# EAGLE design DemoBoard (EAGLE 9.6.2)

## Sheet 1 of 3
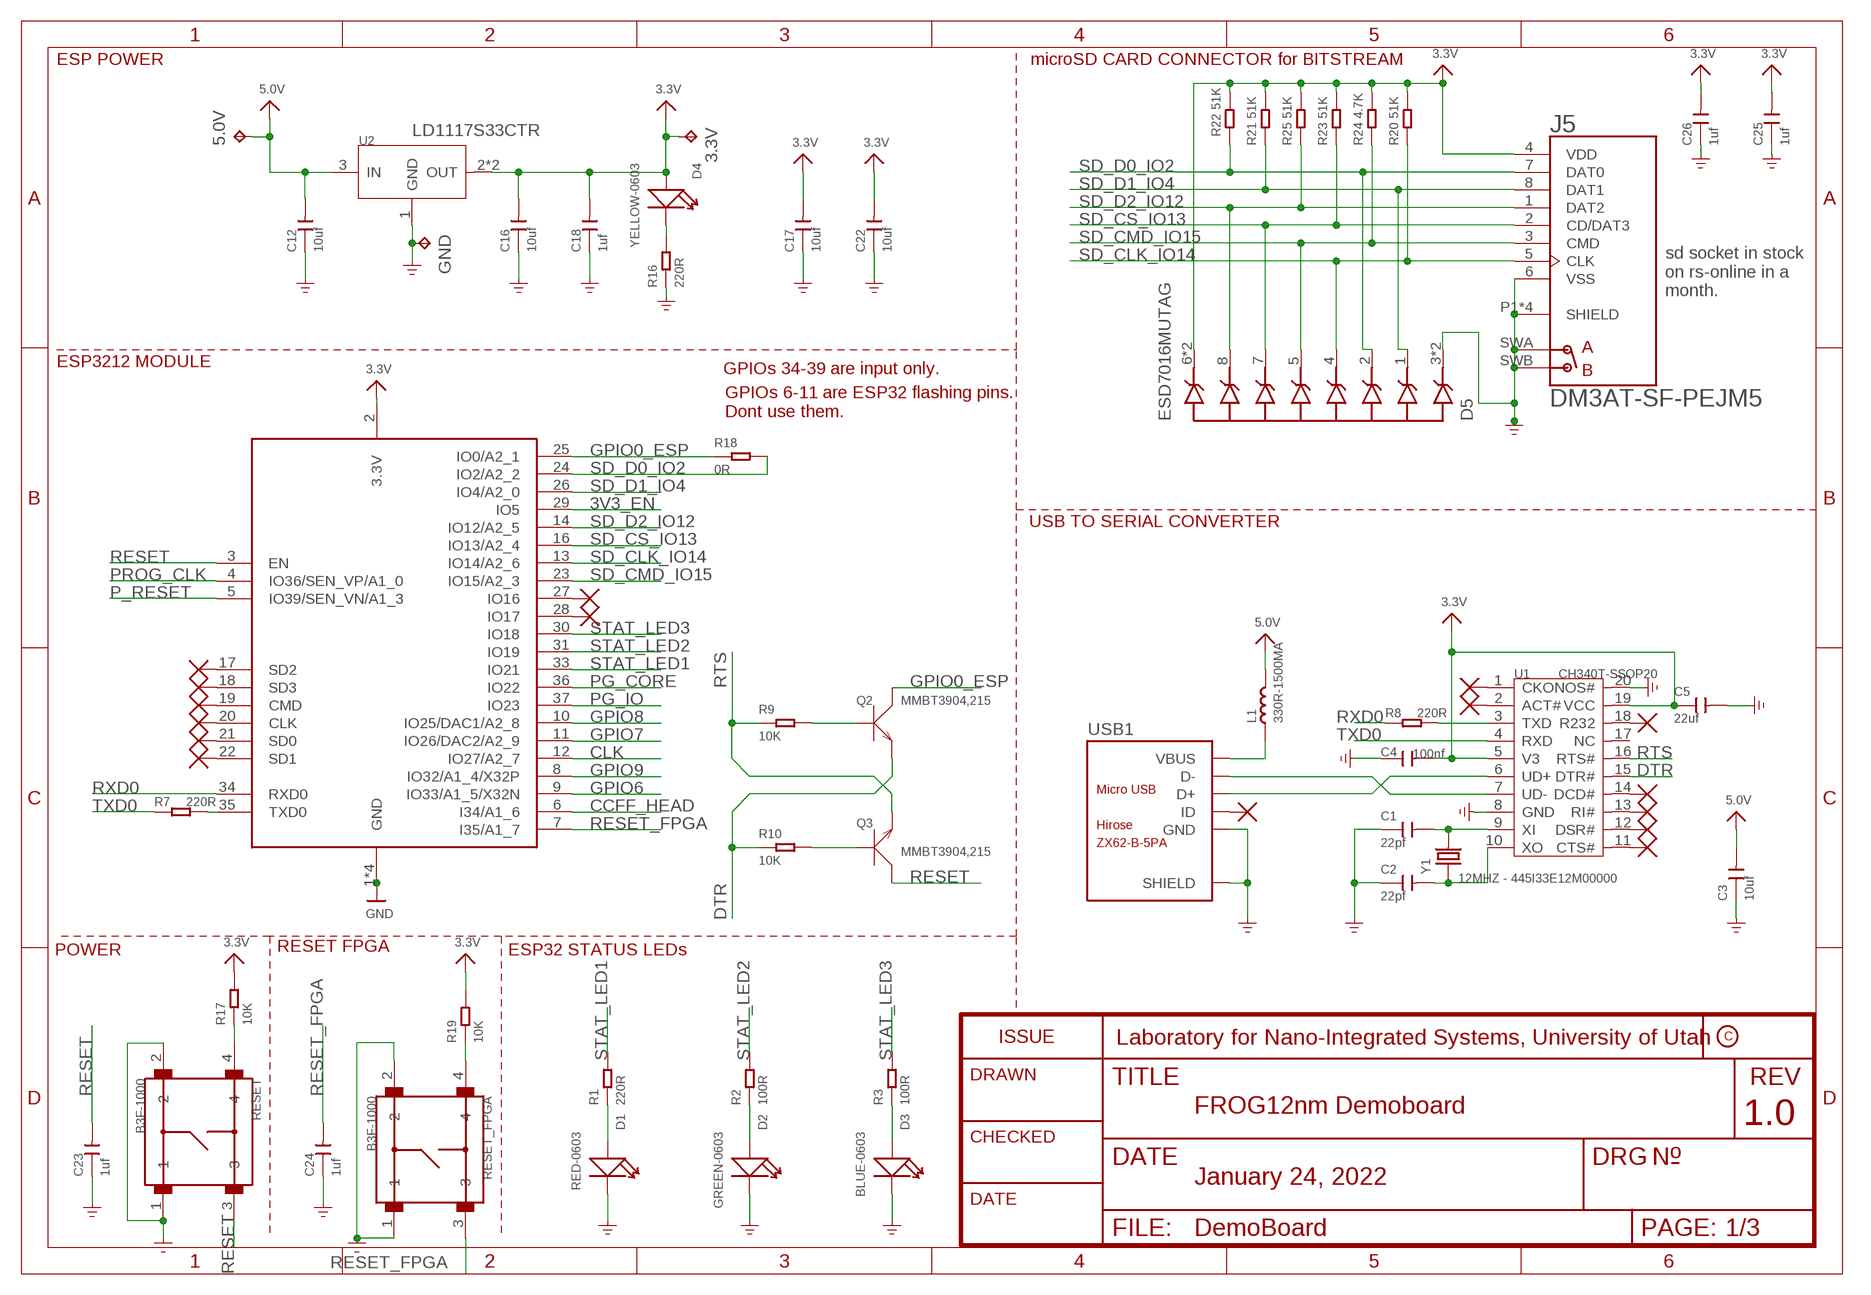
[diagram p0: schematic, sheet 1]
FRAME1 (FRAME_A4): COMPANY: TETRAD: SENSOR NETWORK SOLUTIONS, LLC; REV: 1.0

### Parts
3.3V  TPTP20SQ  [TP20SQ]
5.0V  TPTP20SQ  [TP20SQ]
C1  22pf  CERAMIC-22PF-50V-5%-NPO(0603)  [C0603]
C2  22pf  CERAMIC-22PF-50V-5%-NPO(0603)  [C0603]
C3  10uf  CERAMIC-10UF-10V-10%-X5R(0603)  [C0603]
C4  100nf  CERAMIC-100NF-50V-10%-X7R(0603)  [C0603]
C5  22uf  CERAMIC-22UF-6.3V-20%-X5R(0805)  [C0805]
C12  10uf  CERAMIC-10UF-10V-10%-X5R(0603)  [C0603]
C16  10uf  CERAMIC-10UF-10V-10%-X5R(0603)  [C0603]
C17  10uf  CERAMIC-10UF-10V-10%-X5R(0603)  [C0603]
C18  1uf  CERAMIC-1UF-25V-10%-X7R(0603)  [C0603]
C22  10uf  CERAMIC-10UF-10V-10%-X5R(0603)  [C0603]
C23  1uf  CERAMIC-1UF-25V-10%-X7R(0603)  [C0603]
C24  1uf  CERAMIC-1UF-25V-10%-X7R(0603)  [C0603]
C25  1uf  CERAMIC-1UF-25V-10%-X7R(0603)  [C0603]
C26  1uf  CERAMIC-1UF-25V-10%-X7R(0603)  [C0603]
D1  RED-0603  LED-SMD-RED-DIFFUSED(0603)  [LED-0603]
D2  GREEN-0603  SMD-LED-CLEAR-GREEN(0603)  [LED-0603]
D3  BLUE-0603  SMD-LED-CLEAR-BLUE(0603)  [LED-0603]
D4  YELLOW-0603  SMD-LED-CLEAR-YELLOW(0603)  [LED-0603]
D5  ESD7016MUTAG  [TVS_ESD7016MUTAG]
GND  TPTP20SQ  [TP20SQ]
J5  DM3AT-SF-PEJM5  [HRS_DM3AT-SF-PEJM5]
L1  330R-1500MA  SMD-FERRITE-BEAD-330R-1500MA(0805)'0805'  [L0805]
Q2  MMBT3904,215  SMD-TRANSISTORS-NPN-40V-200MA-MMBT3904LT1G(SOT-23)  [SOT-23]
Q3  MMBT3904,215  SMD-TRANSISTORS-NPN-40V-200MA-MMBT3904LT1G(SOT-23)  [SOT-23]
R1  220R  SMD-RES-220R-5%-1/10W(0603)  [R0603]
R2  100R  SMD-RES-10R-5%-1/10W(0603)  [R0603]
R3  100R  SMD-RES-100R-5%-1/10W(0603)  [R0603]
R7  220R  SMD-RES-220R-5%-1/10W(0603)  [R0603]
R8  220R  SMD-RES-220R-5%-1/10W(0603)  [R0603]
R9  10K  SMD-RES-10K-1%-1/10W(0603)  [R0603]
R10  10K  SMD-RES-10K-1%-1/10W(0603)  [R0603]
R16  220R  SMD-RES-220R-5%-1/10W(0603)  [R0603]
R17  10K  SMD-RES-10K-1%-1/10W(0603)  [R0603]
R18  0R  SMD-RES-0R-5%-1/10W(0603)  [R0603]
R19  10K  SMD-RES-10K-1%-1/10W(0603)  [R0603]
R20  51K  SMD-RES-51K-5%-1/10W(0603)  [R0603]
R21  51K  SMD-RES-51K-5%-1/10W(0603)  [R0603]
R22  51K  SMD-RES-51K-5%-1/10W(0603)  [R0603]
R23  51K  SMD-RES-51K-5%-1/10W(0603)  [R0603]
R24  4.7K  SMD-RES-4.7K-5%-1/10W(0603)  [R0603]
R25  51K  SMD-RES-51K-5%-1/10W(0603)  [R0603]
RESET  B3F-1000  [SW_B3F-1000]
RESET_FPGA  B3F-1000  [SW_B3F-1000]
U1  CH340T-SSOP20  INTERFACE-CH340T(SSOP20)  [SSOP20-0.65-7.6X5.2MM]
U2  PMIC-CJT1117-3.3(SOT223)  [SOT-223]
U3  ESP32_WROOM32_SKINNY  [WROOM32_SKINNY]
U$4  NC_MARKER  (no package)
U$5  NC_MARKER  (no package)
U$42  NC_MARKER  (no package)
U$44  NC_MARKER  (no package)
U$55  NC_MARKER  (no package)
U$57  NC_MARKER  (no package)
U$59  NC_MARKER  (no package)
U$60  NC_MARKER  (no package)
U$65  NC_MARKER  (no package)
U$66  NC_MARKER  (no package)
U$67  NC_MARKER  (no package)
U$68  NC_MARKER  (no package)
U$69  NC_MARKER  (no package)
U$78  NC_MARKER  (no package)
U$81  NC_MARKER  (no package)
U$85  NC_MARKER  (no package)
USB1  ZX62-B-5PA  MICRO-USB-SMD(ZX62-B-5PA)  [MICRO-USB5+6P-SMD-0.65-AB]
Y1  12MHZ - 445I33E12M00000  SMD-CRYSTAL-12MHZ-20PF-20PPM-40R(2P-5.0X3.2MM)  [X2-SMD-5.0X3.2X1.3MM]

### Nets
3.3V: 3.3V.TP C4.2 C5.1 C16.2 C17.2 C18.2 C22.2 C25.2 C26.2 D4.+ D5.6(GND) D5.9(GND) J5.4(VDD) R17.2 R19.2 R20.2 R21.2 R22.2 R23.2 R24.2 R25.2 U1.5(V3) U1.19(VCC) U2.2(OUT) U2.TER(OUT) U3.2(3.3V) ; also sheet 2,3
3V3_EN: U3.29(IO5) ; also sheet 3
5.0V: 5.0V.TP C3.2 C12.2 L1.2 U2.3(IN) ; also sheet 2
CCFF_HEAD: U3.6(I34/A1_6) ; also sheet 2
CLK: U3.12(IO27/A2_7) ; also sheet 2,3
DTR: Q2.2(E) R10.1 U1.15(DTR#)
GND: C1.1 C2.1 C3.1 C4.1 C5.2 C12.1 C16.1 C17.1 C18.1 C22.1 C23.1 C24.1 C25.1 C26.1 D1.- D2.- D3.- D5.3(VBUS) D5.10(VBUS) GND.TP J5.6(VSS) J5.P1(SHIELD) J5.P2(SHIELD) J5.P3(SHIELD) J5.P4(SHIELD) J5.SWA(A) J5.SWB(B) R16.1 RESET.1 RESET.2 RESET_FPGA.1 RESET_FPGA.2 U1.8(GND) U1.20(NOS#) U2.1(GND) U3.1(GND) U3.15(GND) U3.38(GND) U3.P$1(GND) USB1.5(GND) USB1.P1(SHIELD) USB1.P2(SHIELD) USB1.P3_1(SHIELD) USB1.P3_2(SHIELD) USB1.P3_3(SHIELD) USB1.P4_1(SHIELD) USB1.P4_2(SHIELD) USB1.P4_3(SHIELD) USB1.P5(SHIELD) USB1.P6(SHIELD) ; supply symbol labelled GND_POWER ; also sheet 2,3
GPIO0_ESP: Q2.3(C) R18.1 U3.25(IO0/A2_1)
GPIO6: U3.9(IO33/A1_5/X32N) ; also sheet 2,3
GPIO7: U3.11(IO26/DAC2/A2_9) ; also sheet 2,3
GPIO8: U3.10(IO25/DAC1/A2_8) ; also sheet 2,3
GPIO9: U3.8(IO32/A1_4/X32P) ; also sheet 2,3
N$1: D2.+ R2.1
N$2: R17.1 RESET.4
N$3: R19.1 RESET_FPGA.4
N$7: D1.+ R1.1
N$12: Q3.1(B) R10.2
N$13: Q2.1(B) R9.2
N$22: D3.+ R3.1
N$25: D4.- R16.2
N$26: U1.7(UD-) USB1.2(D-)
N$27: U1.6(UD+) USB1.3(D+)
N$28: C1.2 U1.9(XI) Y1.2
N$29: C2.2 U1.10(XO) Y1.1
N$30: R8.2 U1.3(TXD)
N$33: R7.2 U3.35(TXD0)
N$48: U3.17(SD2) U$42.P$1
N$50: U3.18(SD3) U$44.P$1
N$51: U3.19(CMD) U$55.P$1
N$52: U3.20(CLK) U$57.P$1
N$53: U3.21(SD0) U$59.P$1
N$54: U3.22(SD1) U$60.P$1
N$64: U1.14(DCD#) U$4.P$1
N$65: U1.13(RI#) U$5.P$1
N$66: U1.12(DSR#) U$65.P$1
N$67: U1.11(CTS#) U$66.P$1
N$68: U1.18(R232) U$67.P$1
N$69: U1.1(CKO) U$68.P$1
N$70: U1.2(ACT#) U$69.P$1
N$72: U$78.P$1 USB1.4(ID)
N$73: U3.27(IO16) U$81.P$1
N$75: U3.28(IO17) U$85.P$1
P_RESET: U3.5(IO39/SEN_VN/A1_3) ; also sheet 2
PG_CORE: U3.36(IO22) ; also sheet 2
PG_IO: U3.37(IO23) ; also sheet 2
PROG_CLK: U3.4(IO36/SEN_VP/A1_0) ; also sheet 2
RESET: C23.2 Q3.3(C) RESET.3 U3.3(EN)
RESET_FPGA: C24.2 RESET_FPGA.3 U3.7(I35/A1_7) ; also sheet 2
RTS: Q3.2(E) R9.1 U1.16(RTS#)
RXD0: R8.1 U3.34(RXD0)
SD_CLK_IO14: D5.4(I/O3) J5.5(CLK) R20.1 U3.13(IO14/A2_6)
SD_CMD_IO15: D5.5(I/O4) J5.3(CMD) R24.1 U3.23(IO15/A2_3)
SD_CS_IO13: D5.7(I/O5) J5.2(CD/DAT3) R23.1 U3.16(IO13/A2_4)
SD_D0_IO2: D5.2(I/O2) J5.7(DAT0) R18.2 R22.1 U3.24(IO2/A2_2)
SD_D1_IO4: D5.1(I/O1) J5.8(DAT1) R21.1 U3.26(IO4/A2_0)
SD_D2_IO12: D5.8(I/O6) J5.1(DAT2) R25.1 U3.14(IO12/A2_5)
STAT_LED1: R1.2 U3.33(IO21)
STAT_LED2: R2.2 U3.31(IO19)
STAT_LED3: R3.2 U3.30(IO18)
TXD0: R7.1 U1.4(RXD)
VBUS: L1.1 USB1.1(VBUS)
Unconnected: U1.17(NC)

### Notes on the sheet
- ESP POWER | microSD CARD CONNECTOR for BITSTREAM
- sd socket in stock 
  on rs-online in a 
  month.
- ESP3212 MODULE
- GPIOs 34-39 are input only.
- GPIOs 6-11 are ESP32 flashing pins.
  Dont use them.
- USB TO SERIAL CONVERTER
- POWER | RESET FPGA | ESP32 STATUS LEDs
- Laboratory for Nano-Integrated Systems, University of Utah
- FROG12nm Demoboard
- January 24, 2022

## Sheet 2 of 3
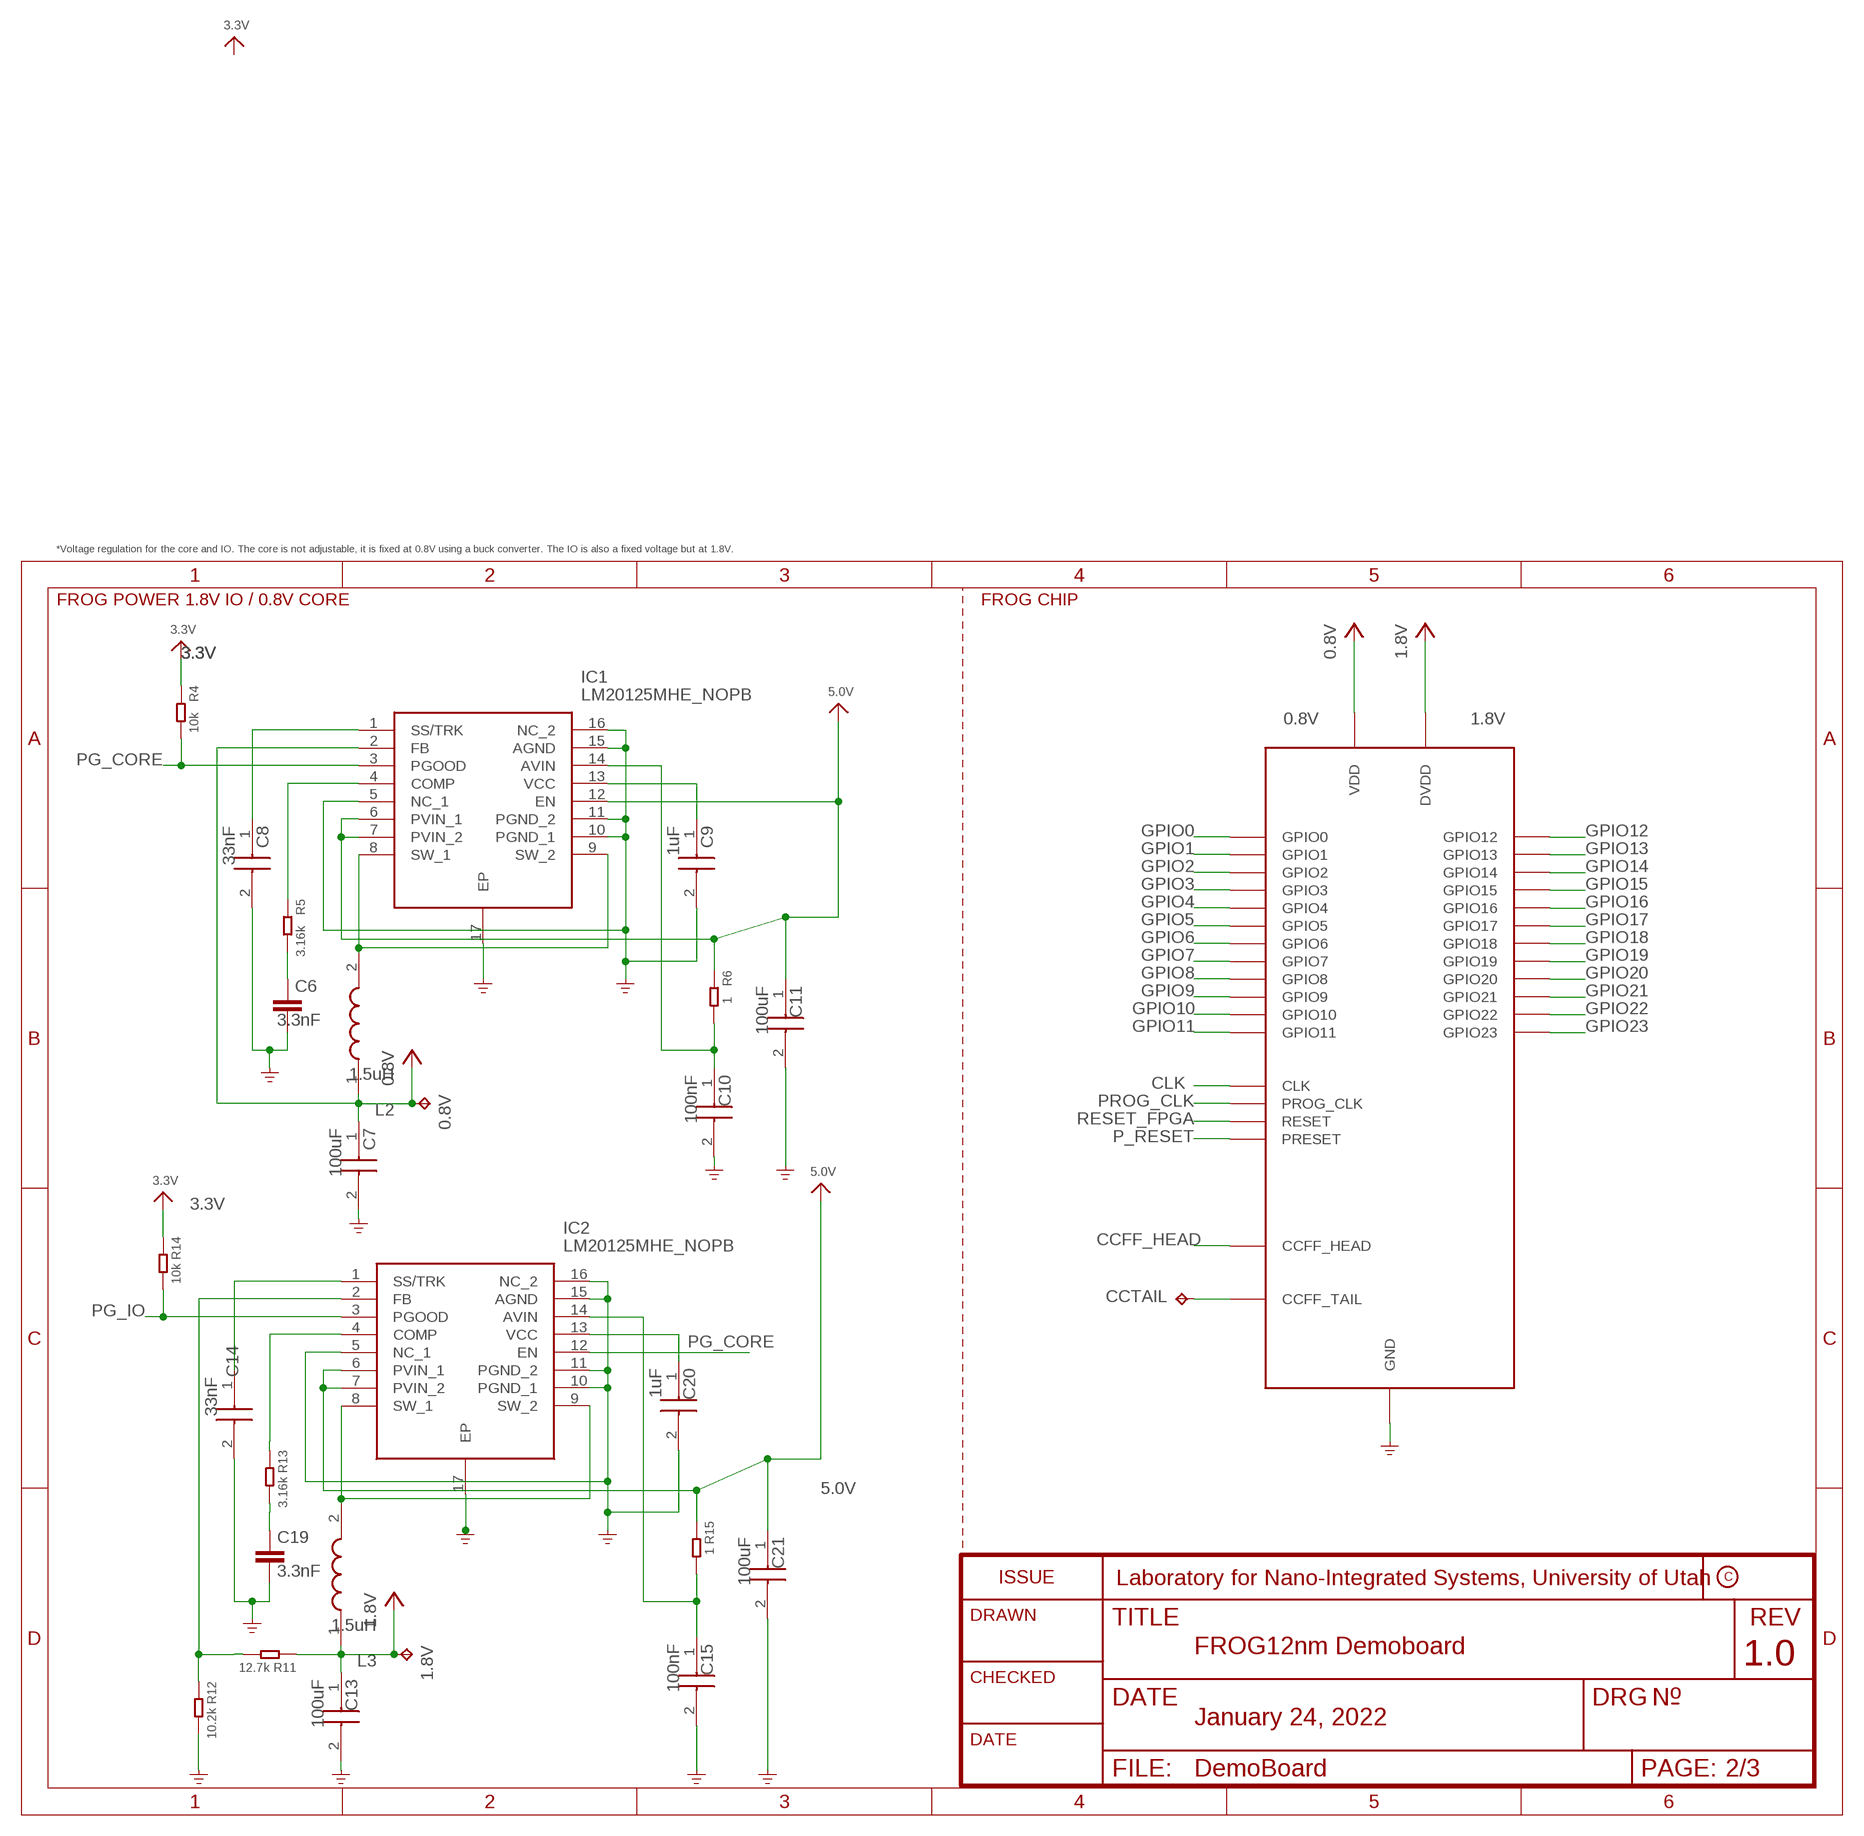
[diagram p1: schematic, sheet 2]
FRAME2 (FRAME_A4): COMPANY: TETRAD: SENSOR NETWORK SOLUTIONS, LLC; REV: 1.0

### Parts
0.8V  TPTP20SQ  [TP20SQ]
1.8V  TPTP20SQ  [TP20SQ]
C6  3.3nF  C_CHIP-0603(1608-METRIC)  [CAPC1608X85]
C7  100uF  GRM32ER60J107ME20L  [CAPC3225X270N]
C8  33nF  VJ0603Y333KXXAC  [CAPC1608X97N]
C9  1uF  GRM155R61E105KA12D  [CAPC1005X55N]
C10  100nF  GCM155R71C104KA55D  [CAPC1005X55N]
C11  100uF  GRM32ER60J107ME20L  [CAPC3225X270N]
C13  100uF  GRM32ER60J107ME20L  [CAPC3225X270N]
C14  33nF  VJ0603Y333KXXAC  [CAPC1608X97N]
C15  100nF  GCM155R71C104KA55D  [CAPC1005X55N]
C19  3.3nF  C_CHIP-0603(1608-METRIC)  [CAPC1608X85]
C20  1uF  GRM155R61E105KA12D  [CAPC1005X55N]
C21  100uF  GRM32ER60J107ME20L  [CAPC3225X270N]
CCTAIL  TPPAD1-13  [P1-13]
IC1  LM20125MHE_NOPB  [SOP65P640X120-17N]
IC2  LM20125MHE_NOPB  [SOP65P640X120-17N]
L2  1.5uH  FDSD0630-H-1R0MB=P3  [INDPM7066X300N]
L3  1.5uH  FDSD0630-H-1R0MB=P3  [INDPM7066X300N]
R4  10k  SMD-RES-4.7K-5%-1/10W(0603)  [R0603]
R5  3.16k  SMD-RES-4.7K-5%-1/10W(0603)  [R0603]
R6  1  SMD-RES-4.7K-5%-1/10W(0603)  [R0603]
R11  12.7k  SMD-RES-4.7K-5%-1/10W(0603)  [R0603]
R12  10.2k  SMD-RES-4.7K-5%-1/10W(0603)  [R0603]
R13  3.16k  SMD-RES-4.7K-5%-1/10W(0603)  [R0603]
R14  10k  SMD-RES-4.7K-5%-1/10W(0603)  [R0603]
R15  1  SMD-RES-4.7K-5%-1/10W(0603)  [R0603]
U5  FROG12NMCOBCOB  [FROG_COB]

### Nets
0.8V: 0.8V.TP C7.1 IC1.2(FB) L2.1 U5.VDD_CORE(VDD)
1.8V: 1.8V.TP C13.1 L3.1 R11.1 U5.VDD_IO(DVDD)
3.3V: R4.1 R14.1 ; also sheet 1,3
5.0V: C11.1 C21.1 IC1.6(PVIN_1) IC1.7(PVIN_2) IC1.12(EN) IC2.6(PVIN_1) IC2.7(PVIN_2) R6.1 R15.1 ; also sheet 1
CCFF_HEAD: U5.CCFFHEAD(CCFF_HEAD) ; also sheet 1
CLK: U5.CLK ; also sheet 1,3
GND: C6.2 C7.2 C8.2 C9.2 C10.2 C11.2 C13.2 C14.2 C15.2 C19.2 C20.2 C21.2 IC1.5(NC_1) IC1.10(PGND_1) IC1.11(PGND_2) IC1.15(AGND) IC1.16(NC_2) IC1.17(EP) IC2.5(NC_1) IC2.10(PGND_1) IC2.11(PGND_2) IC2.15(AGND) IC2.16(NC_2) IC2.17(EP) R12.2 U5.GND ; supply symbol labelled GND_POWER ; also sheet 1,3
GPIO0: U5.GPIO0 ; also sheet 3
GPIO1: U5.GPIO1 ; also sheet 3
GPIO2: U5.GPIO2 ; also sheet 3
GPIO3: U5.GPIO3 ; also sheet 3
GPIO4: U5.GPIO4 ; also sheet 3
GPIO5: U5.GPIO5 ; also sheet 3
GPIO6: U5.GPIO6 ; also sheet 1,3
GPIO7: U5.GPIO7 ; also sheet 1,3
GPIO8: U5.GPIO8 ; also sheet 1,3
GPIO9: U5.GPIO9 ; also sheet 1,3
GPIO10: U5.GPIO10 ; also sheet 3
GPIO11: U5.GPIO11 ; also sheet 3
GPIO12: U5.GPIO12 ; also sheet 3
GPIO13: U5.GPIO13 ; also sheet 3
GPIO14: U5.GPIO14 ; also sheet 3
GPIO15: U5.GPIO15 ; also sheet 3
GPIO16: U5.GPIO16 ; also sheet 3
GPIO17: U5.GPIO17 ; also sheet 3
GPIO18: U5.GPIO18 ; also sheet 3
GPIO19: U5.GPIO19 ; also sheet 3
GPIO20: U5.GPIO20 ; also sheet 3
GPIO21: U5.GPIO21 ; also sheet 3
GPIO22: U5.GPIO22 ; also sheet 3
GPIO23: U5.GPIO23 ; also sheet 3
N$14: IC1.4(COMP) R5.1
N$17: C6.1 R5.2
N$20: C9.1 IC1.13(VCC)
N$34: C8.1 IC1.1(SS/TRK)
N$35: IC1.8(SW_1) IC1.9(SW_2) L2.2
N$36: CCTAIL.TP U5.CCFFTAIL(CCFF_TAIL)
N$37: C10.1 IC1.14(AVIN) R6.2
N$38: IC2.4(COMP) R13.1
N$39: C19.1 R13.2
N$40: C20.1 IC2.13(VCC)
N$41: C14.1 IC2.1(SS/TRK)
N$42: IC2.8(SW_1) IC2.9(SW_2) L3.2
N$43: C15.1 IC2.14(AVIN) R15.2
P_RESET: U5.PRESET ; also sheet 1
PG_CORE: IC1.3(PGOOD) IC2.12(EN) R4.2 ; also sheet 1
PG_IO: IC2.3(PGOOD) R14.2 ; also sheet 1
PROG_CLK: U5.PROGCLK(PROG_CLK) ; also sheet 1
RESET_FPGA: U5.RESET ; also sheet 1
VDD_CORE: IC2.2(FB) R11.2 R12.1

### Notes on the sheet
- *Voltage regulation for the core and IO. The core is not adjustable, it is fixed at 0.8V using a buck converter. The IO is also a fixed voltage but at 1.8V.
- FROG POWER 1.8V IO / 0.8V CORE | FROG CHIP
- Laboratory for Nano-Integrated Systems, University of Utah
- FROG12nm Demoboard
- January 24, 2022

## Sheet 3 of 3
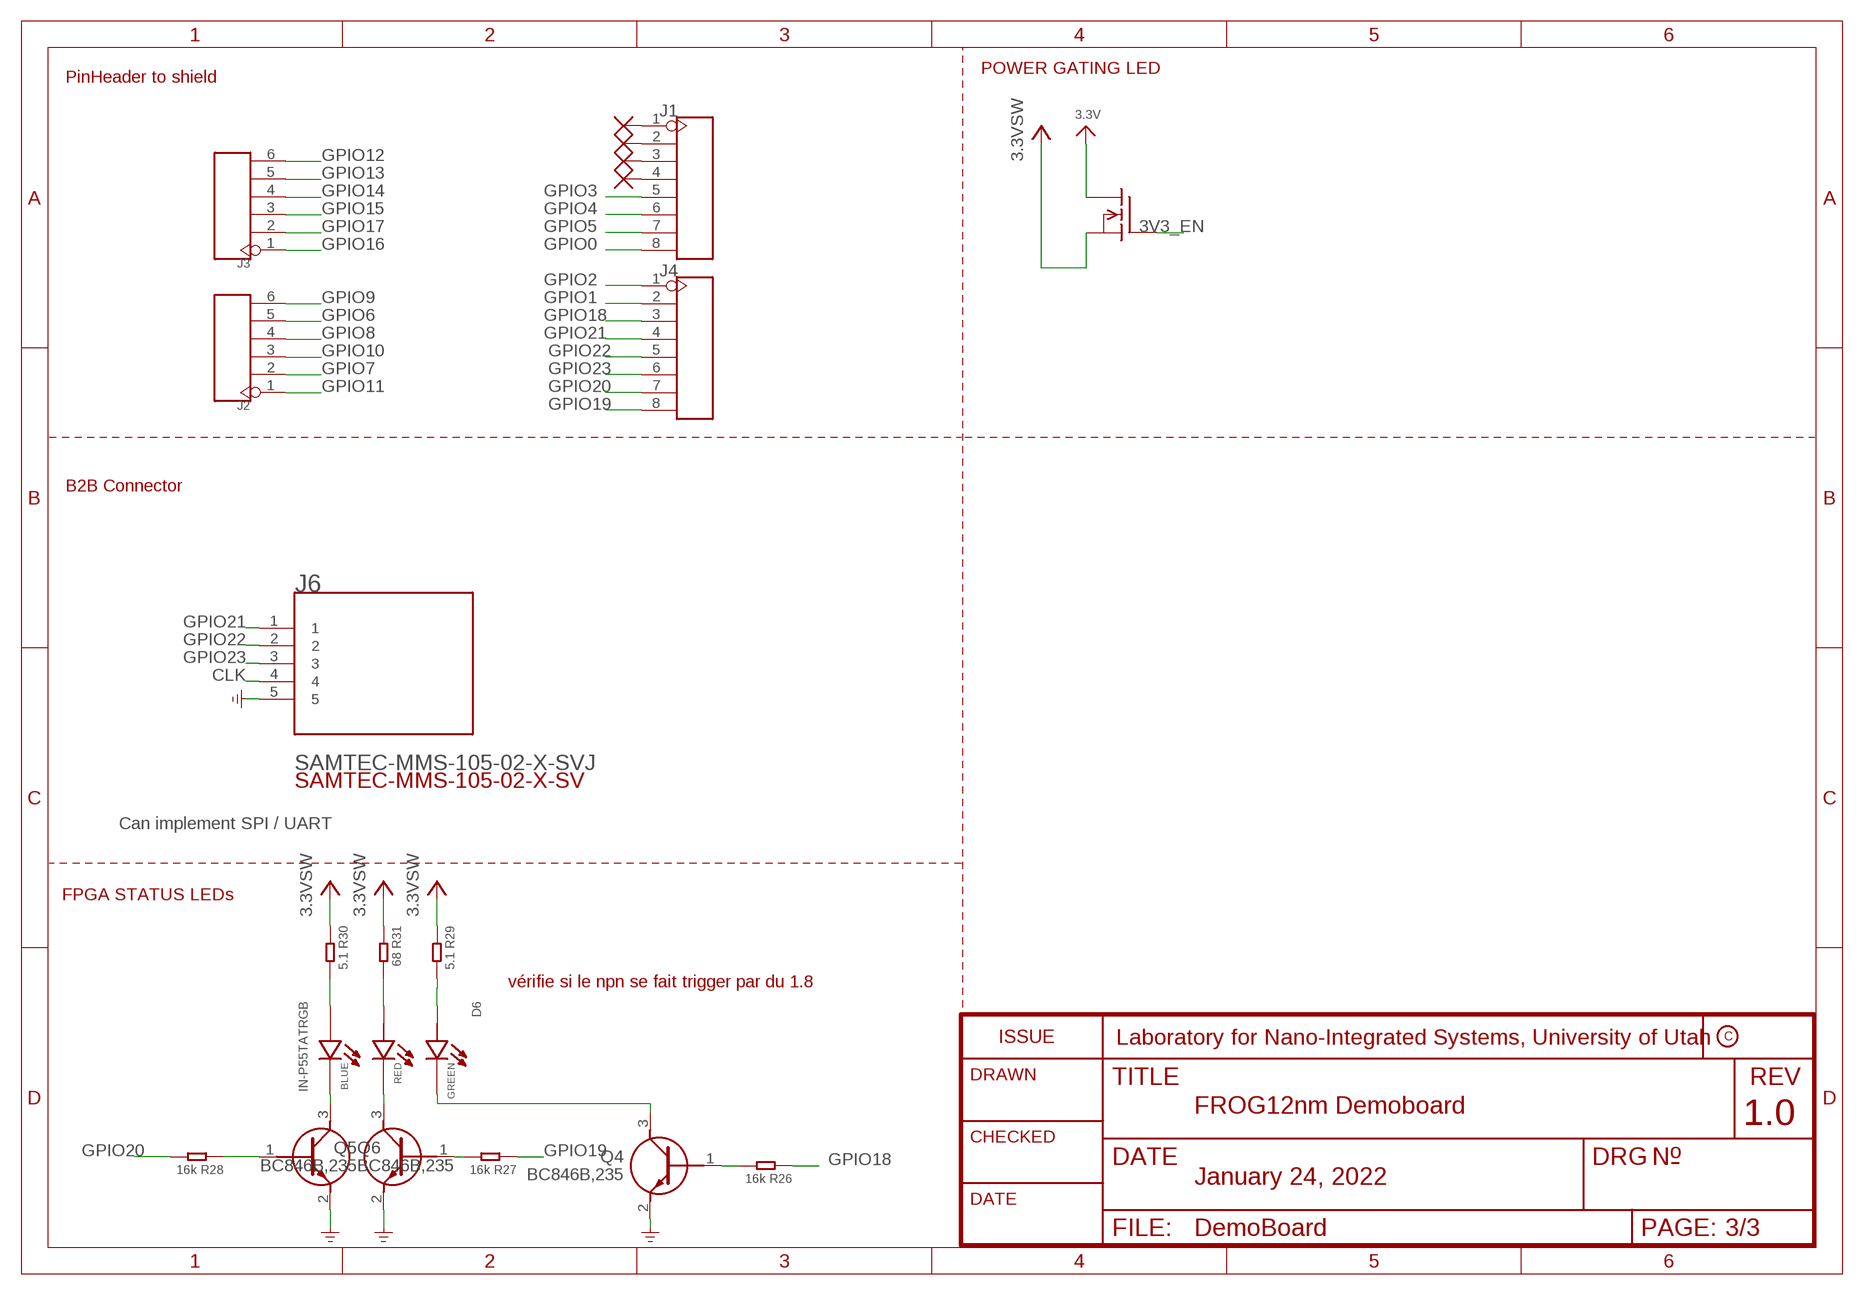
[diagram p2: schematic, sheet 3]
FRAME3 (FRAME_A4): COMPANY: TETRAD: SENSOR NETWORK SOLUTIONS, LLC; REV: 1.0

### Parts
D6  IN-P55TATRGB  [LED_IN-P55TATRGB]
J1  HEADER-8P-2.54  [8P-2.54]
J2  HEADER-6P-55/35MIL  [6P-2.54-55/35MIL]
J3  HEADER-6P-55/35MIL  [6P-2.54-55/35MIL]
J4  HEADER-8P-2.54  [8P-2.54]
J6  SAMTEC-MMS-105-02-X-SVJ  [SAMTEC-MMS-105-02-X-SV]
Q1  IRLML0030TRPBF  [SOT23]
Q4  BC846B,235  [SOT95P230X110-3N]
Q5  BC846B,235  [SOT95P230X110-3N]
Q6  BC846B,235  [SOT95P230X110-3N]
R26  16k  SMD-RES-4.7K-5%-1/10W(0603)  [R0603]
R27  16k  SMD-RES-4.7K-5%-1/10W(0603)  [R0603]
R28  16k  SMD-RES-4.7K-5%-1/10W(0603)  [R0603]
R29  5.1  SMD-RES-4.7K-5%-1/10W(0603)  [R0603]
R30  5.1  SMD-RES-4.7K-5%-1/10W(0603)  [R0603]
R31  68  SMD-RES-4.7K-5%-1/10W(0603)  [R0603]
U$61  NC_MARKER  (no package)
U$62  NC_MARKER  (no package)
U$63  NC_MARKER  (no package)
U$64  NC_MARKER  (no package)

### Nets
3.3V: Q1.3(D) ; also sheet 1,2
3.3VSW: Q1.2(S) R29.1 R30.1 R31.1
3V3_EN: Q1.1(G) ; also sheet 1
CLK: J6.4 ; also sheet 1,2
GND: J6.5 Q4.2(E) Q5.2(E) Q6.2(E) ; supply symbol labelled GND_POWER ; also sheet 1,2
GPIO0: J1.8 ; also sheet 2
GPIO1: J4.2 ; also sheet 2
GPIO2: J4.1 ; also sheet 2
GPIO3: J1.5 ; also sheet 2
GPIO4: J1.6 ; also sheet 2
GPIO5: J1.7 ; also sheet 2
GPIO6: J2.5 ; also sheet 1,2
GPIO7: J2.2 ; also sheet 1,2
GPIO8: J2.4 ; also sheet 1,2
GPIO9: J2.6 ; also sheet 1,2
GPIO10: J2.3 ; also sheet 2
GPIO11: J2.1 ; also sheet 2
GPIO12: J3.6 ; also sheet 2
GPIO13: J3.5 ; also sheet 2
GPIO14: J3.4 ; also sheet 2
GPIO15: J3.3 ; also sheet 2
GPIO16: J3.1 ; also sheet 2
GPIO17: J3.2 ; also sheet 2
GPIO18: J4.3 R26.1 ; also sheet 2
GPIO19: J4.8 R27.1 ; also sheet 2
GPIO20: J4.7 R28.2 ; also sheet 2
GPIO21: J4.4 J6.1 ; also sheet 2
GPIO22: J4.5 J6.2 ; also sheet 2
GPIO23: J4.6 J6.3 ; also sheet 2
N$31: D6.1(B_C) Q6.3(C)
N$32: Q5.1(B) R27.2
N$44: D6.2(R_C) Q5.3(C)
N$45: D6.3(G_C) Q4.3(C)
N$47: Q6.1(B) R28.1
N$49: Q4.1(B) R26.2
N$55: J1.4 U$61.P$1
N$56: J1.3 U$62.P$1
N$57: D6.5(R_A) R31.2
N$58: J1.2 U$63.P$1
N$59: J1.1 U$64.P$1
VCC2: D6.4(G_A) D6.6(B_A) R29.2 R30.2

### Notes on the sheet
- POWER GATING LED
- PinHeader to shield
- B2B Connector
- Can implement SPI / UART
- FPGA STATUS LEDs
- vérifie si le npn se fait trigger par du 1.8
- Laboratory for Nano-Integrated Systems, University of Utah
- FROG12nm Demoboard
- January 24, 2022

## Library data of the parts
0.8V 1.8V 3.3V 5.0V CCTAIL GND = testpad:TP: Test pad
C1 C2 = Seeed-Capacitor:CERAMIC-22PF-50V-5%-NPO(0603): 302010143; MPN: CC0603JRNPO9BN220
C3 C12 C16 C17 C22 = Seeed-Capacitor:CERAMIC-10UF-10V-10%-X5R(0603): 302010103; MPN: CC0603KRX5R6BB106
C4 = Seeed-Capacitor:CERAMIC-100NF-50V-10%-X7R(0603): 302010138; MPN: CC0603KRX7R9BB104
C5 = Seeed-Capacitor:CERAMIC-22UF-6.3V-20%-X5R(0805): 302010171; MPN: CC0805MKX5R5BB226
C6 C19 = Capacitor:C: Capacitor - Generic; CATEGORY: Capacitor
C7 C11 C13 C21 = GRM32ER60J107ME20L:GRM32ER60J107ME20L: 1210 X5R ceramic cap,100uF 6.3V Murata 1210 GRM 100uF Ceramic Multilayer Capacitor, 6.3 V dc, +85C, X5R Dielectric, +/-20% SMD Source: Datasheet <https://datasheet.datasheetarchive.com/originals/distributors/Datasheets_SAMA/ec4f1577dddcc7a13ddad897a28002d3.pdf>; DESCRIPTION: 1210 X5R ceramic cap,100uF 6.3V Murata 1210 GRM 100uF Ceramic Multilayer Capacitor, 6.3 V dc, +85C, X5R Dielectric, +/-20% SMD; HEIGHT: 2.7mm; MANUFACTURER_NAME: Murata Electronics; MANUFACTURER_PART_NUMBER: GRM32ER60J107ME20L; MOUSER_PART_NUMBER: 81-GRM32ER60J107ME20; MOUSER_PRICE-STOCK: https://www.mouser.co.uk/ProductDetail/Murata-Electronics/GRM32ER60J107ME20L?qs=35X%252B5ekJ2E6CDZFQeV9O8Q%3D%3D
C8 C14 = VJ0603Y333KXXAC:VJ0603Y333KXXAC: Vishay VJ0603Y333KXXAC 33nF MLCC 25V dc +/-10% Tolerance SMD Source: Datasheet <http://www.vishay.com/docs/45226/vj31xrohsautomlcc.pdf>; DESCRIPTION: Vishay VJ0603Y333KXXAC 33nF MLCC 25V dc +/-10% Tolerance SMD; HEIGHT: 0.97mm; MANUFACTURER_NAME: Vishay; MANUFACTURER_PART_NUMBER: VJ0603Y333KXXAC; MOUSER_PART_NUMBER: 77-VJ0603Y333KXXAC; MOUSER_PRICE-STOCK: https://www.mouser.co.uk/ProductDetail/Vishay-Vitramon/VJ0603Y333KXXAC?qs=oNxrVNw6PNVD7uvknxabUQ%3D%3D
C9 C20 = GRM155R61E105KA12D:GRM155R61E105KA12D: MURATA - GRM155R61E105KA12D - CAP, MLCC, X5R, 1UF, 25V, 0402 Source: Datasheet <https://psearch.en.murata.com/capacitor/product/GRM155R61E105KA12#.html>; DESCRIPTION: MURATA - GRM155R61E105KA12D - CAP, MLCC, X5R, 1UF, 25V, 0402; HEIGHT: 0.55mm; MANUFACTURER_NAME: Murata Electronics; MANUFACTURER_PART_NUMBER: GRM155R61E105KA12D; MOUSER_PART_NUMBER: 81-GRM155R61E105KA2D; MOUSER_PRICE-STOCK: https://www.mouser.co.uk/ProductDetail/Murata-Electronics/GRM155R61E105KA12D?qs=hiffU4J9V6bE4a81t2Mv5A%3D%3D
C10 C15 = GCM155R71C104KA55D:GCM155R71C104KA55D: Capacitor GCM15 L=1.0mm W=0.5mm T=0.5mm Source: Datasheet <https://psearch.en.murata.com/capacitor/product/GCM155R71C104KA55#.html>; DESCRIPTION: Capacitor GCM15 L=1.0mm W=0.5mm T=0.5mm; HEIGHT: 0.55mm; MANUFACTURER_NAME: Murata Electronics; MANUFACTURER_PART_NUMBER: GCM155R71C104KA55D; MOUSER_PART_NUMBER: 81-GCM155R71C104KA5D; MOUSER_PRICE-STOCK: https://www.mouser.co.uk/ProductDetail/Murata-Electronics/GCM155R71C104KA55D?qs=aEuGZpxfbxVTPYRtXT4ecg%3D%3D
C18 C23-C26 = Seeed-Capacitor:CERAMIC-1UF-25V-10%-X7R(0603): 302010139; MPN: CC0603KRX7R8BB105
D1 = Seeed-LED:LED-SMD-RED-DIFFUSED(0603): 304090042; MPN: 19-217-R6C-AL1M2VY-3T
D2 = Seeed-LED:SMD-LED-CLEAR-GREEN(0603): 304090043; MPN: 19-217-G7C-AN1P2-3T
D3 = Seeed-LED:SMD-LED-CLEAR-BLUE(0603): 304090045; MPN: 19-217-BHC-ZL1M2RY-3T
D4 = Seeed-LED:SMD-LED-CLEAR-YELLOW(0603): 304090044; MPN: 19-217-Y5C-AM1N1VY-3T
D5 = ESD7016MUTAG:ESD7016MUTAG: 10V Clamp 1A (8/20µs) Ipp Tvs Diode Surface Mount 8-UDFN (3.3x1.0) Check prices <https://pricing.snapeda.com/parts/ESD7016MUTAG/ON%20Semiconductor/view-part?ref=eda>; AVAILABILITY: In Stock; DESCRIPTION: 10V Clamp 1A (8/20µs) Ipp Tvs Diode Surface Mount 8-UDFN (3.3x1.0); MF: ON Semiconductor; MP: ESD7016MUTAG; PACKAGE: UDFN-8 ON Semiconductor; PRICE: None; PURCHASE-URL: https://pricing.snapeda.com/search/part/ESD7016MUTAG/?ref=eda
D6 = IN-P55TATRGB:IN-P55TATRGB: Red, Green, Blue (RGB) 624nm Red, 520nm Green, 468nm Blue LED Indication - Discrete 2V Red, 3.2V Green, 3.2V Blue 6-SMD, J-Lead Buy Part <https://snapeda.com/parts/IN-P55TATRGB/Inolux/view-part/?ref=eda>; AVAILABILITY: Warning; DESCRIPTION: Red, Green, Blue (RGB) 624nm Red, 520nm Green, 468nm Blue LED Indication - Discrete 2V Red, 3.2V Green, 3.2V Blue 6-SMD, J-Lead; MF: Inolux; MOUSER-PURCHASE-URL: https://snapeda.com/shop?store=Mouser&id=3600412; MP: IN-P55TATRGB; PACKAGE: SMD-6 Inolux; PRICE: None
IC1 IC2 = LM20125MHE_NOPB:LM20125MHE_NOPB: 2.95-5.5V, 5A, Current Mode Synchronous Buck Regulator with Optional Automotive Grade Source: Datasheet <https://www.ti.com/lit/ds/symlink/lm20125.pdf?ts=1629109190982&ref_url=https%3A%2F%2Fwww.google.com%2F>; DESCRIPTION: 2.95-5.5V, 5A, Current Mode Synchronous Buck Regulator with Optional Automotive Grade; HEIGHT: 1.2mm; MANUFACTURER_NAME: Texas Instruments; MANUFACTURER_PART_NUMBER: LM20125MHE/NOPB; MOUSER_PART_NUMBER: 926-LM20125MHE/NOPB; MOUSER_PRICE-STOCK: https://www.mouser.co.uk/ProductDetail/Texas-Instruments/LM20125MHE-NOPB?qs=X1J7HmVL2ZErox0lMoKn2A%3D%3D
J1 J4 = connector:HEADER-8P
J2 J3 = connector:HEADER-6P
J5 = DM3AT-SF-PEJM5:DM3AT-SF-PEJM5: DM3 Series 8 Position Right Angle SMT Push Push Ejection MicroSD Card Connector Check prices <https://pricing.snapeda.com/search/part/DM3AT-SF-PEJM5/?ref=eda>; AVAILABILITY: Good; DESCRIPTION: Memory Card Connectors R/A SMT MICROSD CON PUSH-PUSH TOP BRDMNT; MF: Hirose Connector; MP: DM3AT-SF-PEJM5; PACKAGE: None; PRICE: None; PURCHASE-URL: https://pricing.snapeda.com/search/part/DM3AT-SF-PEJM5/?ref=eda
J6 = connector5pin:SAMTEC-MMS-105-02-X-SV: Buy Part <https://snapeda.com/parts/MMS-105-02-L-SV-K/Samtec/view-part/?ref=eda>; AVAILABILITY: Bad; DESCRIPTION: 5 Position Receptacle Connector Surface Mount; MF: Samtec; MP: MMS-105-02-L-SV-K; PACKAGE: None; PRICE: None
L1 = Seeed-Inductor:SMD-FERRITE-BEAD-330R-1500MA(0805): 303030006; MPN: BLM21PG331SN1D
L2 L3 = FDSD0630-H-1R0MB=P3:FDSD0630-H-1R0MB=P3: Fixed Inductors 2726 30VDC 1uH 20% 13400mA Source: Datasheet; DESCRIPTION: Fixed Inductors 2726 30VDC 1uH 20% 13400mA; HEIGHT: 3mm; MANUFACTURER_NAME: Murata Electronics; MANUFACTURER_PART_NUMBER: FDSD0630-H-1R0MB=P3; MOUSER_PART_NUMBER: 81-FDSD0630H1R0MB=P3; MOUSER_PRICE-STOCK: https://www.mouser.co.uk/ProductDetail/Murata-Electronics/FDSD0630-H-1R0MB%3dP3?qs=OlC7AqGiEDkXEYHel%252BUfZw%3D%3D
Q1 = IRLML0030TRPBF:IRLML0030TRPBF: P-CHANNEL MOS FET
Q2 Q3 = Seeed-Transistor:SMD-TRANSISTORS-NPN-40V-200MA-MMBT3904LT1G(SOT-23): 305010013; MPN: MMBT3904LT1G; VALUE: MMBT3904LT1G
Q4-Q6 = BC846B_235:BC846B,235: BC846 series - 65 V, 100 mA NPN general-purpose transistors Source: Datasheet <http://assets.nexperia.com/documents/data-sheet/BC846_SER.pdf>; DESCRIPTION: BC846 series - 65 V, 100 mA NPN general-purpose transistors; HEIGHT: 1.1mm; MANUFACTURER_NAME: Nexperia; MANUFACTURER_PART_NUMBER: BC846B,235; MOUSER_PART_NUMBER: 771-BC846B235; MOUSER_PRICE-STOCK: https://www.mouser.co.uk/ProductDetail/Nexperia/BC846B235?qs=me8TqzrmIYV6j%2F8Z1FkTHw%3D%3D
R1 R7 R8 R16 = Seeed-Resistor:SMD-RES-220R-5%-1/10W(0603): 301010163; MPN: RC0603JR-07220RL
R2 = Seeed-Resistor:SMD-RES-10R-5%-1/10W(0603): 301010096; MPN: RC0603JR-0710RL; VALUE: 10R
R3 = Seeed-Resistor:SMD-RES-100R-5%-1/10W(0603): 301010090; MPN: RC0603JR-07100RL
R4-R6 R11-R15 R26-R31 = Seeed-Resistor-2016:SMD-RES-4.7K-5%-1/10W(0603): 301010290; MPN: RC0603JR-074K7L; VALUE: 4.7K
R9 R10 R17 R19 = Seeed-Resistor:SMD-RES-10K-1%-1/10W(0603): 301010299; MPN: RC0603FR-0710KL
R18 = Seeed-Resistor:SMD-RES-0R-5%-1/10W(0603): 301010292; MPN: RC0603JR-070RL
R20-R23 R25 = Seeed-Resistor-2016:SMD-RES-51K-5%-1/10W(0603): 301010145; MPN: RC0603JR-0751KL
R24 = Seeed-Resistor-2016:SMD-RES-4.7K-5%-1/10W(0603): 301010290; MPN: RC0603JR-074K7L
RESET RESET_FPGA = B3F-1000:B3F-1000: Switch, FLUX TIGHT MECHANICAL KEYSwitch, , 50MA@24VDC, NO GROUND TERM., FLAT PLUNG Check prices <https://pricing.snapeda.com/search/part/B3F-1000/?ref=eda>; AVAILABILITY: Good; DESCRIPTION: Tactile Switch SPST-NO Top Actuated Through Hole; MF: Omron; MP: B3F-1000; PACKAGE: None; PRICE: None; PURCHASE-URL: https://pricing.snapeda.com/search/part/B3F-1000/?ref=eda
U1 = Seeed-IC:INTERFACE-CH340T(SSOP20): 310070026; MPN: CH340T
U2 = Seeed-IC:PMIC-CJT1117-3.3(SOT223): 310030097; MPN: LD1117S33CTR; VALUE: CJT1117-3.3-SOT223
U3 = microbuilder:ESP32_WROOM32
U5 = BGASolder:FROG12NMCOB
U$4 U$5 U$42 U$44 U$55 U$57 U$59-U$69 U$78 U$81 U$85 = NC_MARKER:NC_MARKER
USB1 = Seeed-Connector:MICRO-USB-SMD(ZX62-B-5PA): 320010005; MPN: ZX62-B-5PA
Y1 = Seeed-Crystal Oscillator:SMD-CRYSTAL-12MHZ-20PF-20PPM-40R(2P-5.0X3.2MM): 306010047; MPN: 5032/2P; VALUE: 12MHZ

## Board
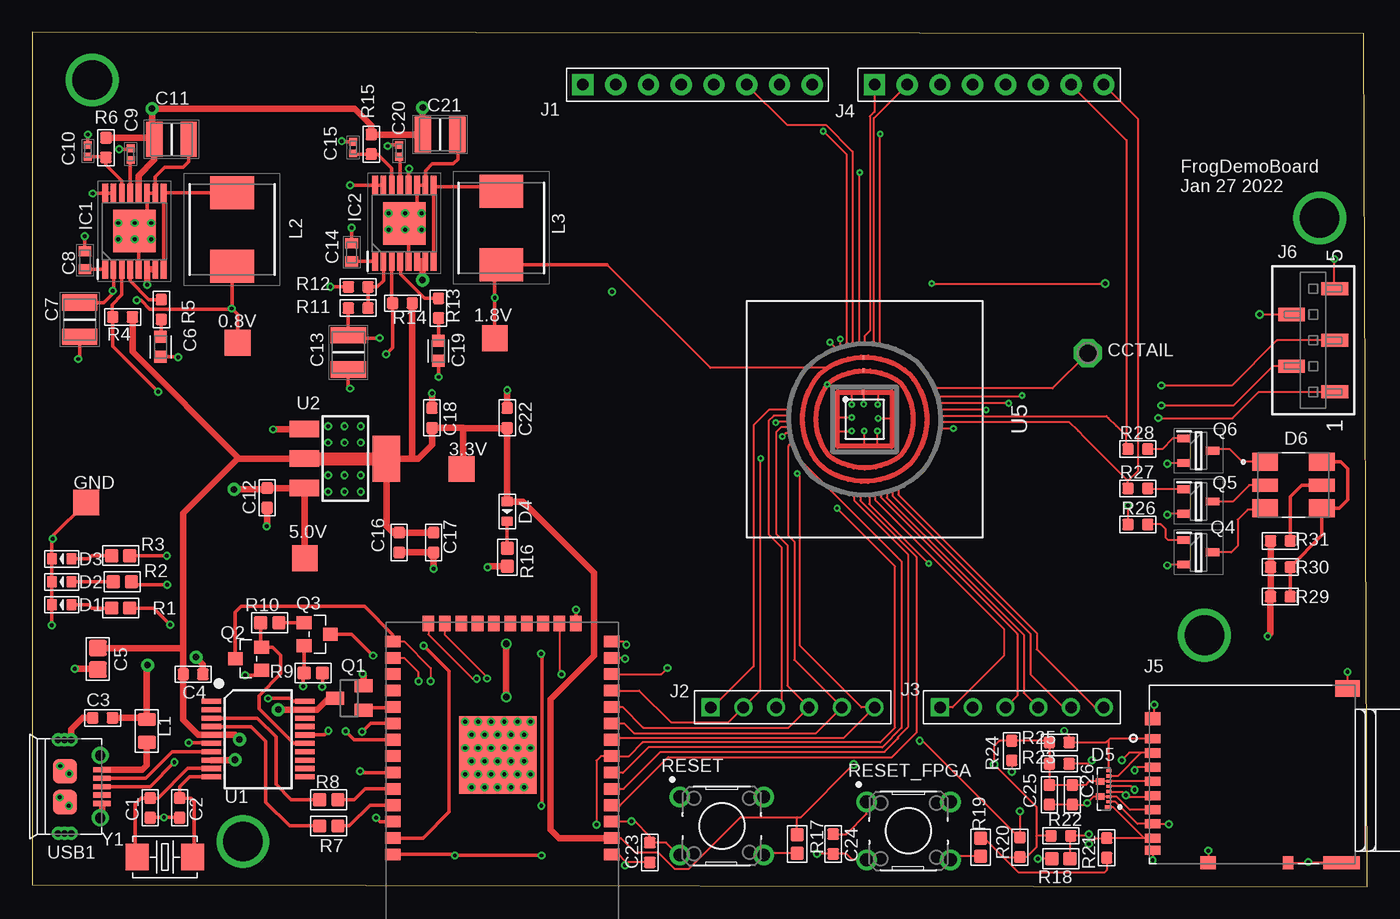
[diagram p3: board, top side]
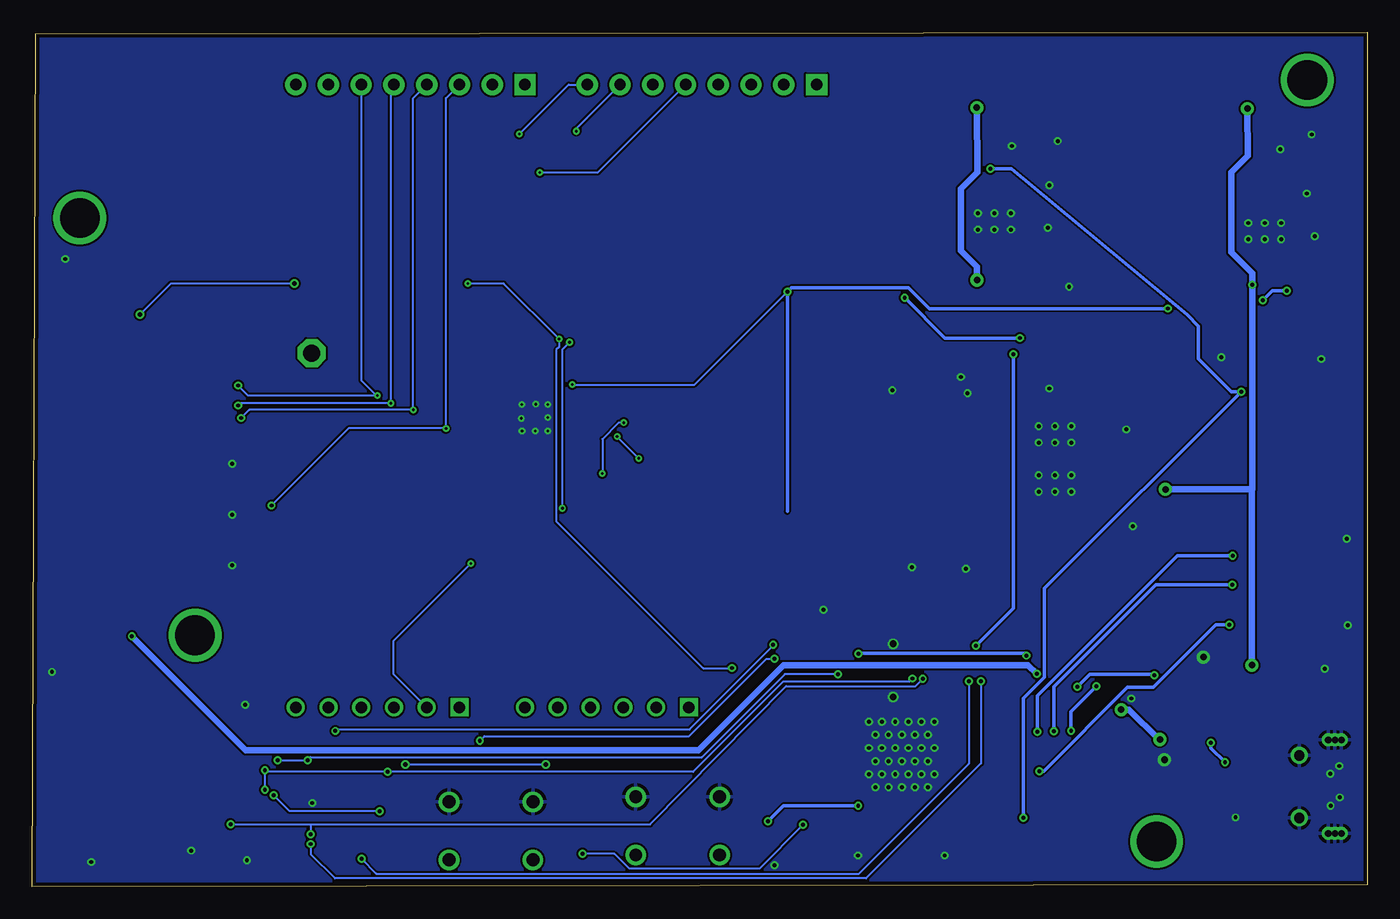
[diagram p4: board, bottom side, seen from below]

Size 103.51 x 66.22 mm. Coordinates in mm from the lower left corner, seen from the top.
Outline: 0,0.13 103.51,0 103.26,66.09 0,66.22 0,0.13
Copper layers (1*16): Top 0.035mm / dielectric 1.5mm / Bottom 0.035mm
Design rules "default *": minimum track width 6mil, minimum drill 8mil, track to track 6mil, track to pad 6mil, pad to pad 6mil, via to via 6mil, smd to smd 0mil, copper to edge 12mil, drill to drill 12mil, minimum pad ring 10mil, minimum via ring 6mil, stop-mask expansion 2mil, vias tented up to drill 0mil, thermal gap 10mil

### Footprints (pad centres in the part's own frame; a part is rotated, then mirrored left to right if it is on the bottom)
TP20SQ = smd 2 x 2: TP 0,0
C0603 = smd 0.889 x 0.889: 1 0,0.762; 2 0,-0.762
C0805 = smd 1.397 x 1.27: 1 0,0.835; 2 0,-0.835
CAPC1608X85 = smd 0.921 x 0.97: 1 -0.775,0; 2 0.775,0
CAPC3225X270N = smd 1.26 x 2.72: 1 -1.33,0; 2 1.33,0
CAPC1608X97N = smd 0.78 x 0.98: 1 -0.7,0; 2 0.7,0
CAPC1005X55N = smd 0.6 x 0.62: 1 -0.46,0; 2 0.46,0
P1-13 = drill 1.321 pad 2.159 octagon: TP 0,0
LED-0603 = smd 0.762 x 0.889: + -0.762,0; - 0.762,0
TVS_ESD7016MUTAG = smd 0.5 x 0.25: 1 -0.35,1.4 | smd 0.4 x 0.25: 2 -0.4,1; 3 -0.4,0.6; 4 -0.4,0.2; 5 -0.4,-0.2; 6 -0.4,-0.6; 7 -0.4,-1; 8 -0.4,-1.4 | smd 0.65 x 0.5: 9 0.275,-0.58; 10 0.275,0.58
LED_IN-P55TATRGB = smd 2 x 1.4: 1 -2.2,1.8; 3 -2.2,-1.8; 4 2.2,-1.8; 6 2.2,1.8 | smd 2 x 1: 2 -2.2,0; 5 2.2,0
SOP65P640X120-17N = smd 1.475 x 0.45: 1 -2.938,2.275; 2 -2.938,1.625; 3 -2.938,0.975; 4 -2.938,0.325; 5 -2.938,-0.325; 6 -2.938,-0.975; 7 -2.938,-1.625; 8 -2.938,-2.275; 9 2.938,-2.275; 10 2.938,-1.625; 11 2.938,-0.975; 12 2.938,-0.325; 13 2.938,0.325; 14 2.938,0.975; 15 2.938,1.625; 16 2.938,2.275 | smd 3.3 x 3.3: 17 0,0
8P-2.54 = drill 0.889 pad 1.651 square: 1 0,8.89 | drill 0.889 pad 1.651: 2 0,6.35; 3 0,3.81; 4 0,1.27; 5 0,-1.27; 6 0,-3.81; 7 0,-6.35; 8 0,-8.89
6P-2.54-55/35MIL = drill 0.889 pad 1.397 square: 1 0,6.35 | drill 0.889 pad 1.397: 2 0,3.81; 3 0,1.27; 4 0,-1.27; 5 0,-3.81; 6 0,-6.35
HRS_DM3AT-SF-PEJM5 = smd 0.7 x 1.2: 1 3.2,0; 2 2.1,0; 3 1,0; 4 -0.1,0; 5 -1.2,0; 6 -2.3,0; 7 -3.4,0; 8 -4.5,0; SWB -5.45,0 | smd 1 x 1.2: P1 -6.4,-4.3; P4 4.75,0 | smd 1 x 2.8: P2 -6.4,-14.65 | smd 1.3 x 1.9: P3 7.1,-15.1 | smd 1 x 0.8: SWA -6.4,-10.5
SAMTEC-MMS-105-02-X-SV = smd 1.016 x 2.085: 1 -4,-1.677; 2 -2,1.677; 3 0,-1.677; 4 2,1.677; 5 4,-1.677
L0805 = smd 1.016 x 1.397: 1 -0.889,0; 2 0.889,0
INDPM7066X300N = smd 2.55 x 3.4: 1 -2.85,0; 2 2.85,0
SOT23 = smd 1 x 1.4: 1 -0.95,-1.1; 2 0.95,-1.1; 3 0,1.1
SOT-23 = smd 1.016 x 1.143: 1 -0.889,-1.016; 2 0.889,-1.016; 3 0,1.016
SOT95P230X110-3N = smd 1.05 x 0.6: 1 -1.1,0.95; 2 -1.1,-0.95; 3 1.1,0
R0603 = smd 1.016 x 1.016: 1 0,0.708; 2 0,-0.708
R0603' = smd 0.889 x 0.889: 1 0,0.762; 2 0,-0.762
SW_B3F-1000 = drill 1 pad 1.6: 1 -3.25,2.25; 2 3.25,2.25; 3 -3.25,-2.25; 4 3.25,-2.25
SSOP20-0.65-7.6X5.2MM = smd 0.4 x 1.5: 1 -2.925,-3.625; 2 -2.275,-3.625; 3 -1.625,-3.625; 4 -0.975,-3.625; 5 -0.325,-3.625; 6 0.325,-3.625; 7 0.975,-3.625; 8 1.625,-3.625; 9 2.275,-3.625; 10 2.925,-3.625; 11 2.925,3.625; 12 2.275,3.625; 13 1.625,3.625; 14 0.975,3.625; 15 0.325,3.625; 16 -0.325,3.625; 17 -0.975,3.625; 18 -1.625,3.625; 19 -2.275,3.625; 20 -2.925,3.625
SOT-223 = smd 1.27 x 2.286: 1 -2.286,-3.175; 2 0,-3.175; 3 2.286,-3.175 | smd 3.556 x 2.159: TER 0,3.175
WROOM32_SKINNY = smd 1.2 x 0.9: 1 -8.5,5; 2 -8.5,3.73; 3 -8.5,2.46; 4 -8.5,1.19; 5 -8.5,-0.08; 6 -8.5,-1.35; 7 -8.5,-2.62; 8 -8.5,-3.89; 9 -8.5,-5.16; 10 -8.5,-6.43; 11 -8.5,-7.7; 12 -8.5,-8.97; 13 -8.5,-10.24; 14 -8.5,-11.51; 25 8.5,-11.51; 26 8.5,-10.24; 27 8.5,-8.97; 28 8.5,-7.7; 29 8.5,-6.43; 30 8.5,-5.16; 31 8.5,-3.89; 32 8.5,-2.62; 33 8.5,-1.35; 34 8.5,-0.08; 35 8.5,1.19; 36 8.5,2.46; 37 8.5,3.73; 38 8.5,5 | smd 0.9 x 1.2: 15 -5.7,-12.9; 16 -4.43,-12.9; 17 -3.16,-12.9; 18 -1.89,-12.9; 19 -0.62,-12.9; 20 0.65,-12.9; 21 1.92,-12.9; 22 3.19,-12.9; 23 4.46,-12.9; 24 5.73,-12.9 | smd 6 x 6: P$1 0.34,-2.7
FROG_COB = smd 0.152 x 0.305: CCFFHEAD 2.468,-5.379; CCFFTAIL -2.389,5.421; GPIO6 1.549,-5.69; GPIO7 1.092,-5.791; GPIO8 0.635,-5.842; GPIO9 0.175,-5.875; GPIO10 -0.276,-5.875; GPIO11 -0.737,-5.842; GPIO18 0.702,5.825; GPIO19 0.2,5.875; GPIO20 -0.276,5.875; GPIO21 -0.778,5.824; GPIO22 -1.278,5.749; GPIO23 -1.779,5.624 | smd 0.305 x 0.152: CLK -5.613,-1.854; GPIO0 -5.791,1.168; GPIO1 -5.842,0.711; GPIO2 -5.893,0; GPIO3 -5.867,-0.483; GPIO4 -5.817,-0.94; GPIO5 -5.74,-1.397; GPIO12 5.308,2.611; GPIO13 5.457,2.159; GPIO14 5.632,1.708; GPIO15 5.756,1.257; GPIO16 5.829,0.806; GPIO17 5.878,0.357; PRESET 5.849,-0.821; PROGCLK 5.876,-0.346; RESET -5.436,-2.311; VDD_CORE -3.8,-0.1; VDD_IO -4.8,-0.1 | smd 0.406 x 0.203: GND -2.1,-0.1
MICRO-USB5+6P-SMD-0.65-AB = smd 0.4 x 1.35: 1 -1.3,2.875; 2 -0.65,2.875; 3 0,2.875; 4 0.65,2.875; 5 1.3,2.875 | smd 1.9 x 1.9: P1 -1.2,0; P2 1.2,0 | drill 0.508 pad 1.016: P3_1 -3.625,-0.533; P3_2 -3.625,-0.025; P3_3 -3.625,0.483; P4_1 3.625,-0.533; P4_2 3.625,-0.025; P4_3 3.625,0.483 | drill 0.8: P5 -2.425,2.73; P6 2.425,2.73
X2-SMD-5.0X3.2X1.3MM = smd 1.778 x 2.032: 1 -2.159,0; 2 2.159,0

### Placement (x,y rotation side)
0.8V  15.93,42.16 0 top
1.8V  35.86,42.49 0 top
3.3V  33.3,32.36 0 top
5.0V  21.13,25.45 0 top
C1  9.14,6.1 180 top
C2  11.43,6.1 180 top
C3  5.46,13.08 90 top
C4  12.47,16.46 270 top
C5  5.08,17.65 0 top
C6  9.96,41.83 270 top
C7  3.68,43.94 270 top
C8  4.09,48.54 90 top
C9  7.62,56.77 90 top
C10  4.32,57.02 90 top
C11  10.79,57.91 0 top
C12  18.21,30.12 180 top
C13  24.51,41.4 270 top
C14  24.77,49.15 90 top
C15  24.89,57.28 90 top
C16  28.45,26.67 180 top
C17  31.11,26.67 180 top
C18  30.99,36.32 0 top
C19  31.5,41.53 270 top
C20  28.45,57.02 90 top
C21  31.62,58.29 0 top
C22  36.83,36.32 0 top
C23  47.88,2.64 180 top
C24  62.1,3.3 0 top
C25  78.87,7.11 180 top
C26  80.64,7.11 180 top
CCTAIL  81.84,41.35 0 top
D1  2.29,21.84 180 top
D2  2.29,23.62 180 top
D3  2.29,25.4 180 top
D4  36.83,29.08 270 top
D5  83.08,7.57 180 top
D6  97.79,31.11 0 top
GND  4.19,29.77 0 top
IC1  7.92,50.8 90 top
IC2  28.85,51.41 90 top
J1  51.59,62.15 90 top
J2  58.95,13.89 90 top
J3  76.73,13.89 90 top
J4  74.19,62.15 90 top
J5  86.87,8.26 90 top
J6  99.31,42.34 90 top
L1  8.89,12.07 90 top
L2  15.49,50.93 90 top
L3  36.37,51.05 90 top
Q1  24.59,14.61 90 top
Q2  16.76,17.65 90 top
Q3  22.1,19.56 270 top
Q4  90.42,25.91 0 top
Q5  90.42,29.84 0 top
Q6  90.42,33.78 0 top
R1  6.86,21.59 90 top
R2  6.99,23.62 90 top
R3  6.86,25.65 90 top
R4  10k  [R0603']  7.01,44.15 270 top
R5  3.16k  [R0603']  10.01,44.73 0 top
R6  1  [R0603']  5.71,57.28 0 top
R7  22.99,4.7 90 top
R8  22.99,6.73 270 top
R9  21.79,16.56 90 top
R10  18.41,20.45 90 top
R11  12.7k  [R0603']  25.27,44.83 90 top
R12  10.2k  [R0603']  25.27,46.48 270 top
R13  3.16k  [R0603']  31.5,44.83 0 top
R14  10k  [R0603']  28.7,45.21 270 top
R15  1  [R0603']  26.29,57.53 0 top
R16  36.83,25.53 180 top
R17  59.31,3.3 180 top
R18  79.76,2.16 90 top
R19  73.53,3.05 180 top
R20  51K  [R0603']  76.58,3.05 0 top
R21  51K  [R0603']  83.31,3 0 top
R22  51K  [R0603']  79.76,3.94 270 top
R23  51K  [R0603']  79.63,9.53 270 top
R24  4.7K  [R0603']  75.95,10.54 180 top
R25  51K  [R0603']  79.63,11.18 270 top
R26  16k  [R0603']  85.72,28.07 90 top
R27  16k  [R0603']  85.72,30.86 90 top
R28  16k  [R0603']  85.72,33.91 270 top
R29  5.1  [R0603']  96.77,22.48 90 top
R30  5.1  [R0603']  96.77,24.77 90 top
R31  68  [R0603']  96.77,26.8 90 top
RESET  53.47,4.7 0 top
RESET_FPGA  67.94,4.32 0 top
U1  17.53,11.43 270 top
U2  24.28,33.17 270 top
U3  36.45,7.49 180 top
U5  64.54,36.22 270 top
USB1  2.54,7.75 270 top
Y1  10.29,2.29 180 top

### Tracks (layer width: path | path; a pad name or v marks a point on that pad's centre or on a via)
0.8V  (via drill 0.2, 0.3)
  Top 0.152: L2.1 15.49,47.82 | U5.VDD_CORE 63.69,40.02 63.42,39.75 62.76,39.75 62.28,39.27 61.95,39.27 61.65,38.96 v61.65,38.91
  Top 0.254: C7.1 5.54,45.27 6.31,46.04 IC1.2 6.3,46.23 v6.25,46.18 | v8.1,45.44 8.44,45.44 9.11,44.77 15.38,44.77 15.49,44.88 | 15.49,47.82 15.49,44.88 | 15.49,44.88 15.49,44.78 v15.47,44.81 15.93,44.35 0.8V.TP
  Bottom 0.152: v61.65,38.91 52.15,38.91 v44.96,46.1
  Bottom 0.254: v6.25,46.18 7.37,46.18 v8.1,45.44 | v15.47,44.81 33.93,44.81 35.56,46.43 44.63,46.43 v44.96,46.1 44.96,29.08
1.8V  (via drill 0.3)
  Top 0.152: U5.VDD_IO 64.42,41 63.52,41 63.35,40.82 62.94,40.82 62.74,40.62 62.38,40.62 62.23,40.46 62.03,40.46 61.77,40.21 52.57,40.21 44.58,48.2
  Top 0.254: R11.1 C13.1 24.72,42.52 v26.92,42.52 | 44.58,48.2 L3.1 35.87,47.7 v35.87,45.64 1.8V.TP
  Bottom 0.254: v26.92,42.52 32.74,42.52 v35.87,45.64
3.3V  (via drill 0.35, 0.51 pad 1.02)
  Top 0.152: R17.2 59.31,5.39 | 59.31,5.39 54.92,5.39 50.88,1.35 49.83,1.35 48.51,2.67 46.74,2.67 45.64,3.76 U3.2 | 59.31,5.39 59.59,5.39 v63.67,9.47 | R19.2 73.69,3.91 75.31,2.29 | 75.31,2.29 R20.2 77.09,2.29 77.85,3.05 77.85,3.94 | R21.2 83.31,1.27 83.13,1.09 76.51,1.09 75.31,2.29 | R22.2 77.85,3.94 | 77.85,3.94 77.85,6.2 v74.58,9.47 74.57,10.39 74.58,10.39 74.58,10.87 75.01,11.3 R24.2 78.74,11.3 R25.2 R23.2 C25.2 C26.2 81.64,7.87 81.92,8.15 D5.9 83.46,8.15 D5.6 83.5,8.16 J5.4
  Top 0.508: 29.44,33.17 U2.TER 27.46,27.94 27.96,27.43 C16.2 C17.2 | 29.44,33.17 29.92,33.17 30.99,34.24 C18.2 33.4,35.56 33.4,35.51 | 33.4,35.51 36.78,35.51 C22.2 D4.+ 38.05,29.84 43.56,24.33 43.56,17.91 40.18,14.53 40.18,4.42 40.84,3.76 U3.2 | 11.71,18.41 C4.2 11.71,12.92 12.86,11.77 13.88,11.77 U1.5 15.73,11.76 v16.08,11.41 | 11.71,18.41 11.71,20.78 11.68,20.8 11.68,28.93 15.93,33.17 16.05,33.17 | R4.1 7.77,41.45 16.05,33.17 | R14.1 29.44,45.19 29.44,33.17 | v19.07,13.72 U1.19 22.08,13.71 22.98,14.61 Q1.3 | 33.4,35.51 33.4,32.46 3.3V.TP | 11.71,18.41 11.64,18.49 C5.1 | 16.05,33.17 U2.2
  Top 1.016: U2.2 U2.TER
  Bottom 0.152: v74.58,9.47 v63.67,9.47
  Bottom 0.508: v16.08,11.41 16.15,11.41 18.47,13.72 v19.07,13.72
3.3VSW  (via drill 0.3)
  Top 0.508: v25.63,16.48 25.69,16.43 Q1.2 | v95.78,19.41 95.99,19.61 95.99,22.45 R29.1 R30.1 R31.1
  Bottom 0.508: v25.63,16.48 26.31,17.17 45.26,17.17 51.87,10.57 86.94,10.57 v95.78,19.41
3V3_EN
  Top 0.254: U3.29 27.88,13.86 25.89,13.86 Q1.1
5.0V  (via drill 0.3, 0.51 pad 1.02)
  Top 0.508: C3.2 8.64,13.08 8.76,12.95 L1.2 8.89,17.17 v8.94,17.17 | IC1.7 IC1.6 8.91,47.86 v8.91,46.63 | IC2.6 IC2.7 30.25,48.24 v30.25,47.02 | IC1.12 8.25,55.11 9.46,56.33 C11.1 | R6.1 9.37,58.04 9.46,57.95 C11.1 | v30.28,60.38 30.28,58.31 C21.1 30.25,58.29 30.23,58.32 30.2,58.29 R15.1 26.29,59 24.99,60.3 v9.3,60.3 9.3,58.08 C11.1 | v15.65,30.79 18.11,30.79 C12.2 U2.3 21.11,25.48 5.0V.TP
  Bottom 0.508: v30.25,47.02 30.25,48.03 31.5,49.28 31.5,54.1 30.23,55.37 30.25,60.35 v30.28,60.38 | v8.94,17.17 8.94,30.79 | v9.3,60.3 9.27,56.65 10.54,55.37 10.54,49.15 8.91,47.52 v8.91,46.63 8.91,30.79 8.94,30.79 | 8.94,30.79 v15.65,30.79
CCFF_HEAD
  Top 0.152: U3.6 44.98,8.81 45.8,8.81 47.78,10.79 65.91,10.79 67.41,12.29 67.41,25.2 59.16,33.45 U5.CCFFHEAD
CLK  (via drill 0.2, 0.3, 0.35)
  Top 0.152: U3.12 48.77,16.46 v49.25,16.94 | 97.64,44.45 97.74,44.35 | 97.74,44.35 98.09,43.99 | v95.15,44.35 J6.4 | J6.4 97.74,44.35 | J6.4 | U5.CLK 62.66,41.86 v62.66,42.44 | v69.72,46.74 v83.19,46.74
  Bottom 0.152: v83.19,46.74 92.76,46.74 v95.15,44.35 | v69.72,46.74 66.95,46.74 v62.66,42.44 62.66,41.81 62.88,41.59 62.88,28.33 51.49,16.94 v49.25,16.94
DTR
  Top 0.254: U1.15 20.26,11.11 17.58,13.79 17.58,14.81 19.25,16.48 19.25,17.93 18.64,18.54 Q2.2 17.71,18.61 R10.1
GND  (via drill 0.2, 0.3, 0.51, 0.51 pad 1.02)
  Top 0.152: C25.1 C26.1 81.66,6.35 v81.79,6.48 | v81.79,6.48 82.3,6.99 D5.10 83.46,6.99 D5.3 84.09,6.97 85.1,5.96 J5.6 | v81.79,6.48 | J5.SWB v86.87,2.03 | v91.19,2.79 91.17,2.78 J5.P1 | J5.SWA 98.88,1.85 v98.93,1.91 98.98,1.85 J5.P2 | v101.98,16.64 101.97,16.62 J5.P3 | J5.P4 87,13.13 v87,14.1 | C23.1 47.85,1.91 46.23,1.91 v45.97,1.65 45.97,1.98 45.46,2.49 U3.1 | C24.1 63.12,4.06 64.69,5.64 RESET_FPGA.1 | Q4.2 88.08,24.96 v88.01,24.89 | Q5.2 88.08,28.89 v88.01,28.83 | Q6.2 88.08,32.83 v88.01,32.77 | J6.5 100.97,46.37 v100.97,48.64 | v2.16,9.35 2.16,9.33 USB1.P1 2.66,8.95 v2.87,8.74 | v2.13,6.91 2.5,6.55 USB1.P2 2.57,6.55 v2.85,6.27 | U3.P$1 36.11,9.74 v36.09,9.73 | IC1.17 7.29,50.16 v6.68,50.16 | IC2.17 28.85,52.15 v28.91,52.2 | U5.GND 64.44,37.41 v64.47,37.39 | U5.GND 65.54,38.32 65.56,38.3 | 65.56,38.3 v65.56,37.36 | U5.GND 63.52,38.32 | 63.52,38.32 62.45,38.32 62.43,38.3 62.43,36.42 | 62.43,36.42 62.43,35.18 | 62.43,35.18 62.43,34.16 62.46,34.14 64.52,34.14 | 65.68,34.14 66.57,34.14 66.65,34.21 66.65,36.25 | 65.68,34.14 64.52,34.14 | 66.65,36.25 66.65,38.3 65.56,38.3 | 63.52,38.32 v63.52,37.36 | 62.43,36.42 62.48,36.37 v63.52,36.37 | 62.43,35.18 62.56,35.31 v63.52,35.31 | 64.52,34.14 v64.52,35.31 | 65.68,34.14 65.53,34.29 v65.53,35.31 | 66.65,36.25 65.63,36.25 v65.58,36.3
  Top 0.254: C1.1 9.17,5.36 v10.21,5.36 11.4,5.36 C2.1 | v15.72,9.83 15.7,9.81 | U1.20 20.24,14.36 20.02,14.58 v18.29,14.58 | v1.52,20.27 D1.- D2.- D3.- 1.52,26.87 v1.6,26.95 1.6,27.18 GND.TP | IC1.15 IC1.16 4.72,53.74 v4.7,53.72 | C9.2 7.54,57.15 v6.73,57.15 | C8.2 4.06,49.27 v4.06,50.42 | IC1.17 7.54,50.42 7.24,50.42 | C10.2 v4.32,58.29 | 12.12,57.32 C11.2 12.12,56.19 11.68,55.75 10.29,55.75 9.55,55.02 IC1.10 IC1.11 8.9,51.76 v9.22,51.44 | IC2.15 IC2.16 v24.65,54.35 v24.64,54.36 | C7.2 3.68,41.02 v3.56,40.89 | C6.2 11.27,41.06 v11.3,41.02 | C19.2 v31.5,39.5 | C13.2 24.51,38.73 v24.64,38.61 | C14.2 v24.77,51.05 | C20.2 27.64,57.48 v27.56,57.4 | v24,57.79 24.05,57.74 C15.2 | IC2.5 29.18,51.09 IC2.17 29.83,52.39 IC2.11 IC2.10 30.48,55.5 30.99,56.01 32.64,56.01 33.02,56.39 33.02,58.23 C21.2 | R12.2 v23.11,46.48 | U3.15 42.15,21.45 v42.16,21.46 | IC1.5 8.25,49.87 v7.95,50.16 | U3.38 32.69,2.49 v32.77,2.41 v39.5,2.41
  Top 0.508: C3.1 3.92,13.08 3.02,12.19 USB1.P3_3 | USB1.5 5.42,5.47 USB1.P6 | 15.7,9.81 U1.8 | U2.1 18.69,35.46 v18.67,35.43 | C18.1 v30.99,38.23 | C22.1 v36.83,38.48 | R16.1 35.36,24.82 v35.31,24.77 | v31.11,24.64 C17.1 C16.1 | C12.1 18.21,27.99 v18.16,27.94 | C5.2 5.01,16.89 v3.3,16.89 | v12.7,17.78 13.23,17.25 C4.1 | v36.75,18.82 v36.75,14.68
  other vias: 25.48,31.88 25.48,30.61 24.21,30.61 24.21,31.88 22.94,31.88 22.94,30.61 22.94,34.42 24.21,34.42 25.48,34.42 25.48,35.69 24.21,35.69 22.94,35.69 36.6,12.78 35.59,12.78 34.57,12.78 33.55,12.78 38.63,12.78 37.62,12.78 38.13,11.76 37.11,11.76 36.09,11.76 35.08,11.76 34.06,11.76 33.55,10.74 34.57,10.74 35.59,10.74 36.6,10.74 37.62,10.74 38.63,10.74 38.13,9.73 37.11,9.73 35.08,9.73 34.06,9.73 33.55,8.71 34.57,8.71 35.59,8.71 36.6,8.71 37.62,8.71 38.63,8.71 38.13,7.7 37.11,7.7 36.09,7.7 35.08,7.7 34.06,7.7 9.22,50.16 7.95,51.44 6.68,51.44 27.64,50.93 28.91,50.93 30.18,50.93 30.18,52.2 27.64,52.2
  pour Bottom: -2.41,66.8 -2.41,-2.41 -2.29,-2.54 106.4,-2.54 106.78,-2.92 106.78,66.8 106.91,66.93 -2.31,66.93 -2.41,66.83
GPIO0  (via drill 0.2)
  Top 0.152: U5.GPIO0 65.71,58.32 v65.73,58.34
  Bottom 0.152: v65.73,58.34 61.92,62.15 J1.8
GPIO0_ESP  (via drill 0.3)
  Top 0.152: U3.25 28.81,19 30.89,16.93 v30.89,15.93 | R18.1 v77.98,2.16
  Top 0.254: Q2.3 15.75,21.26 16.2,21.72 25.76,21.72 27.95,19.52 U3.25
  Bottom 0.152: v77.98,2.16 76.83,1.01 39.4,1.01 30.89,9.53 v30.89,15.93
GPIO1
  Top 0.152: U5.GPIO1 65.25,59.56 J4.2
GPIO2
  Top 0.152: J4.1 65.3,60.05 64.95,59.69 64.95,43.08 64.54,42.67 U5.GPIO2
GPIO3  (via drill 0.2)
  Top 0.152: v64.16,55.35 64.08,55.27 64.08,42.11 U5.GPIO3
  Bottom 0.152: J1.5 59.66,55.35 v64.16,55.35
GPIO4
  Top 0.152: U5.GPIO4 63.6,56.97 61.54,59.03 58.52,59.03 J1.6
GPIO5  (via drill 0.2)
  Top 0.152: v61.34,58.55 63.14,56.74 U5.GPIO5
  Bottom 0.152: J1.7 61.34,58.75 v61.34,58.55
GPIO6
  Top 0.152: U3.9 45.88,12.65 46.64,11.89 60.76,11.89 J2.5 59.08,17.58 59.08,26.75 58.65,27.18 58.65,34.16 58.85,34.37 U5.GPIO6
GPIO7  (via drill 0.2)
  Top 0.152: U3.11 47.06,15.19 49.55,12.7 53.95,12.7 J2.2 56.41,15.16 56.41,33.12 v56.49,33.2 | U5.GPIO7 58.42,35.13 v58.17,34.87
  Bottom 0.152: v58.17,34.87 v56.49,33.2
GPIO8
  Top 0.152: U3.10 45.77,13.92 47.37,12.32 58.65,12.32 J2.4 58.55,15.57 58.55,26.47 57.68,27.33 57.68,35.23 58.04,35.59 U5.GPIO8
  Bottom 0.152: J2.4 60.23,13.89
GPIO9  (via drill 0.2)
  Top 0.152: U3.8 45.07,11.51 62.92,11.51 J2.6 64.29,13.89 59.49,18.69 59.49,31.83 v59.31,32 | U5.GPIO9 57.75,36.05 v57.66,35.96
  Bottom 0.152: v57.66,35.96 58.04,35.96 59.31,34.69 v59.31,32
GPIO10
  Top 0.152: U5.GPIO10 57.5,36.5 57.1,36.09 57.1,27.3 58.09,26.31 58.09,14.3 J2.3
  Bottom 0.152: J2.3 57.71,13.89
GPIO11
  Top 0.152: U5.GPIO11 57.12,36.96 55.93,35.76 55.93,17.07 52.76,13.89 J2.1
  Bottom 0.152: J2.1 52.68,13.97
GPIO12
  Top 0.152: U5.GPIO12 67.15,30.38 77.88,19.65 77.88,18.39 82.37,13.89 J3.6
GPIO13
  Top 0.152: U5.GPIO13 66.7,30.28 77.39,19.59 77.39,16.46 79.96,13.89 J3.5
GPIO14
  Top 0.152: U5.GPIO14 66.25,30.16 76.89,19.52 76.89,15.01 J3.4
GPIO15
  Top 0.152: U5.GPIO15 65.79,30.18 76.38,19.6 76.38,14.81 J3.3
GPIO16
  Top 0.152: U5.GPIO16 65.35,29.98 75.34,19.99 75.34,17.88 71.35,13.89 J3.1
GPIO17  (via drill 0.2)
  Top 0.152: U5.GPIO17 64.9,29.64 v69.49,25.04
  Bottom 0.152: v69.49,25.04 75.51,19.02 75.51,16.48 J3.2
GPIO18  (via drill 0.2, 0.3)
  Top 0.152: v84.96,29.54 R26.1 | U5.GPIO18 71.42,35.52 v71.42,35.51
  Bottom 0.152: J4.3 71.42,61.11 v71.42,35.51 78.99,35.51 v84.96,29.54
GPIO19
  Top 0.152: 84.96,31.45 R27.1 84.91,30.91 | 84.96,31.5 84.96,31.45 | 84.96,31.45 81.62,34.79 81.09,35.31 80.39,36.02 U5.GPIO19 | J4.8 85.72,59.51 85.72,32.21 84.96,31.45
GPIO20
  Top 0.152: R28.2 84.84,34.04 84.84,34.93 | 84.84,34.93 84.05,35.71 83.45,36.31 83.29,36.47 73.77,36.47 73.74,36.5 U5.GPIO20 | J4.7 84.84,57.86 84.84,34.93
GPIO21  (via drill 0.2, 0.3)
  Top 0.152: v87.33,36.32 87.35,36.3 93.07,36.3 95.11,38.34 J6.1 | U5.GPIO21 73.92,37 v73.97,36.96
  Bottom 0.152: 87.32,36.31 v87.33,36.32 86.69,36.96 v73.97,36.96 73.97,61.11 J4.4
GPIO22  (via drill 0.2, 0.3)
  Top 0.152: v87.55,37.29 93.14,37.29 96.2,40.34 J6.2 | U5.GPIO22 75.66,37.5 v75.69,37.47
  Bottom 0.152: v87.55,37.28 v87.55,37.29 87.38,37.47 v75.69,37.47 75.69,61.93 J4.5
GPIO23  (via drill 0.2, 0.3)
  Top 0.152: J6.3 96.52,42.34 93.01,38.84 v87.55,38.84 | U5.GPIO23 76.71,38 v76.76,38.05
  Bottom 0.152: v76.76,38.05 76.81,38.05 | 76.81,38.05 86.77,38.05 v87.55,38.84 | J4.6 78,39.24 76.81,38.05
N$1
  Top 0.254: R2.1 D2.+
N$2
  Top 0.152: R17.1 56.86,2.59 RESET.4
N$3
  Top 0.152: R19.1 71.47,2.34 RESET_FPGA.4
N$7
  Top 0.254: R1.1 4.63,21.59 4.37,21.84 D1.+
N$12
  Top 0.254: R10.2 Q3.1
N$13  (via drill 0.3)
  Top 0.254: Q2.1 17.4,16.38 v16.51,16.38 | v22.48,15.49 22.5,15.52 R9.2
  Bottom 0.254: v16.51,16.38 16.58,16.46 21.52,16.46 v22.48,15.49
N$14
  Top 0.254: IC1.4 7.59,46.95 9.05,45.49 R5.1
N$17
  Top 0.254: R5.2 10.01,42.66 C6.1
N$20
  Top 0.254: IC1.13 7.6,56.29 C9.1
N$22
  Top 0.254: R3.1 4.63,25.65 4.37,25.4 D3.+
N$25
  Top 0.254: D4.- R16.2
N$26
  Top 0.254: U1.7 10.84,10.46 8.78,8.4 USB1.2
N$27  (via drill 0.3)
  Top 0.254: USB1.3 9.14,7.75 v11.02,9.63 | v12.12,11.15 13.86,11.15 U1.6
  Bottom 0.254: v11.02,9.63 12.12,10.72 v12.12,11.15
N$28
  Top 0.254: U1.9 12.05,9.16 9.75,6.86 C1.2 8.43,6.86 8,6.43 8,2.41 Y1.2
N$29
  Top 0.254: Y1.1 12.57,2.41 12.57,6.59 12.3,6.86 C2.2 11.43,7.75 12.19,8.51 U1.10
N$30
  Top 0.254: U1.3 17.45,13.06 18.9,11.61 18.9,7.92 20.09,6.73 R8.2
N$31
  Top 0.152: D6.1 93.83,32.91 92.84,33.91 91.65,33.91 Q6.3
N$32
  Top 0.152: Q5.1 86.55,30.79 R27.2
N$33
  Top 0.254: R7.2 24.58,4.7 26.19,6.3 U3.35
N$34
  Top 0.254: IC1.1 4.11,47.86 C8.1
N$35
  Top 0.254: IC1.8 IC1.9 10.24,53.78 L2.2
N$36
  Top 0.152: U5.CCFFTAIL 79.1,38.61 CCTAIL.TP
N$37
  Top 0.254: IC1.14 6.93,53.76 6.93,54.72 5.71,55.93 R6.2 5.67,56.56 C10.1
N$38
  Top 0.254: IC2.4 28.55,48.45 28.55,47.48 30.43,45.59 R13.1
N$39
  Top 0.254: C19.1 R13.2
N$40
  Top 0.254: IC2.13 28.53,56.48 C20.1
N$41
  Top 0.254: IC2.1 24.79,48.47 C14.1
N$42
  Top 0.254: IC2.8 IC2.9 31.25,54.23 36.83,54.23 36.96,54.1 36.76,53.9 L3.2
N$43
  Top 0.254: C15.1 24.94,56.77 R15.2 26.8,56.77 27.88,55.69 IC2.14
N$44
  Top 0.152: D6.2 94.36,31.11 93.09,29.84 Q5.3
N$45
  Top 0.152: D6.3 95.48,29.21 94.23,29.21 93.47,28.45 93.47,26.42 92.96,25.91 Q4.3
N$46  (via drill 3.07)
  other vias: 4.65,62.51
N$47
  Top 0.152: Q6.1 88.45,34.73 87.63,33.91 R28.1
N$49
  Top 0.152: Q4.1 88.08,26.86 87.88,27.05 87.88,27.69 87.5,28.07 R26.2
N$57
  Top 0.254: R31.2 97.54,30.23 98.42,31.11 D6.5
N$60  (via drill 3.07)
  other vias: 16.33,3.51
N$62  (via drill 3.07)
  other vias: 90.88,19.48
N$63  (via drill 3.07)
  other vias: 99.82,51.82
P_RESET
  Top 0.152: U3.5 45.86,7.57 48.72,10.44 66.09,10.44 67.09,11.44 | 67.16,11.51 67.09,11.44 | U5.PRESET 63.72,29.94 67.89,25.77 67.89,12.35 67.09,11.54 67.09,11.44
PG_CORE  (via drill 0.3)
  Top 0.254: IC1.3 6.95,45.86 6.2,45.11 6.2,44.2 R4.2 6.25,41.89 v9.78,38.35 | IC2.12 29.18,55.6 v29.21,55.63 | U3.36 26.97,5.03 v26.67,5.33
  Bottom 0.254: v29.21,55.63 27.59,55.63 13.97,44.32 13.08,43.43 13.08,40.89 10.54,38.35 v9.78,38.35 25.02,23.11 25.02,16.23 26.67,14.59 v26.67,5.33
PG_IO  (via drill 0.3)
  Top 0.254: IC2.3 27.88,45.27 R14.2 27.94,41.78 v27.43,41.28 | v30.35,18.67 32.33,16.69 32.33,5.79 30.31,3.76 U3.37
  Bottom 0.254: v27.43,41.28 27.43,21.59 v30.35,18.67
PROG_CLK
  Top 0.152: U3.4 45.58,6.3 49.31,10.03 66.67,10.03 68.56,11.91 68.56,25.55 64.19,29.91 U5.PROGCLK
RESET  (via drill 0.3)
  Top 0.152: RESET.3 50.1,2.45 49.15,3.4 C23.2 47.88,3.91 46.72,5.07 v46.47,5.07 46.44,5.03 U3.3
  Top 0.254: Q3.3 24.77,19.56 v26.42,17.91 | v39.45,18.06 39.52,17.98 39.52,6.33 v39.47,6.27
  Bottom 0.254: v26.42,17.91 26.59,18.08 39.42,18.08 v39.45,18.06 | v39.47,6.27 45.26,6.27 v46.47,5.07
RESET_FPGA  (via drill 0.2, 0.3)
  Top 0.152: RESET_FPGA.3 63.59,2.07 63.12,2.54 C24.2 v60.83,2.54 | v43.74,4.8 43.74,9.77 44.08,10.11 U3.7 46.27,10.11 47.33,11.18 65.76,11.18 66.9,12.32 66.9,24.82 v62.4,29.32 | v61.85,42.19 62.23,41.81 U5.RESET
  Bottom 0.152: v60.83,2.54 58.36,2.54 57.22,1.4 47.14,1.4 v43.74,4.8 | v62.4,29.32 62.4,41.64 v61.85,42.19
RTS  (via drill 0.3)
  Top 0.254: U1.16 22.66,11.76 22.96,12.07 v22.96,12.09 | v21.01,15.52 21.01,16.48 R9.1 | 21.11,16.59 R9.1 | R9.1 Q3.2
  Bottom 0.254: v22.96,12.09 22.96,13.56 v21.01,15.52
RXD0
  Top 0.254: R8.1 24.96,6.73 25.81,7.57 U3.34
SD_CLK_IO14  (via drill 0.3)
  Top 0.152: D5.4 83.53,7.32 84.54,7.32 v84.78,7.08 84.94,6.93 86.74,6.93 J5.5 | v76.58,5.84 R20.1 76.5,3.81 69.01,11.3 v68.81,11.3 | U3.13 45.89,17.73 v45.97,17.65
  Bottom 0.152: v76.58,5.84 83.54,5.84 v84.78,7.08 | v45.97,17.65 46.58,17.65 52.58,11.66 68.45,11.66 v68.81,11.3
SD_CMD_IO15  (via drill 0.3)
  Top 0.152: J5.3 85.71,9.26 v85.47,9.02 | v85.47,7.5 85.2,7.77 D5.5 | v35.26,16.13 35.26,16.24 31.99,19.5 U3.23 | R24.1 v75.95,8.89
  Bottom 0.152: v85.47,7.5 v85.47,9.02 85.34,8.89 v75.95,8.89 52.27,8.89 45.26,15.9 35.48,15.9 v35.26,16.13
SD_CS_IO13  (via drill 0.3)
  Top 0.152: J5.2 85.96,10.36 | 85.96,10.36 85.98,10.38 85.06,10.38 v84.48,9.8 | 85.96,10.36 84.17,8.57 D5.7 | v82.17,9.8 81.89,9.53 R23.1 | U3.16 40.88,16.63 v41.05,16.46
  Bottom 0.152: v84.48,9.8 v82.17,9.8 81.94,10.03 51.59,10.03 45.16,16.46 v41.05,16.46
SD_D0_IO2  (via drill 0.3)
  Top 0.152: D5.2 83.98,6.57 85.7,4.85 J5.7 88.11,4.85 v88.14,4.83 | 80.46,3.88 R22.1 81.79,3.94 v81.92,4.06 81.84,3.99 | 80.46,3.88 80.46,3.07 R18.2 | 80.39,4.06 80.46,3.99 80.46,3.88 | v34.47,16.1 34.14,16.1 30.72,19.53 U3.24
  Bottom 0.152: v88.14,4.83 81.92,4.83 | 81.92,4.83 v81.92,4.06 | v34.47,16.1 35.03,15.54 45.06,15.54 55.6,4.83 81.92,4.83
SD_D1_IO4  (via drill 0.3)
  Top 0.152: D5.1 83.82,6.17 86.24,3.75 J5.8 R21.1 82.37,3.76 v81.92,3.3 | v29.95,15.93 29.95,16.6 28.81,17.73 U3.26
  Bottom 0.152: v81.92,3.3 81.92,2.52 80.03,0.63 38.86,0.63 29.95,9.55 v29.95,15.93
SD_D2_IO12  (via drill 0.3)
  Top 0.152: 86.56,11.15 J5.1 83.54,11.46 83.48,11.4 | D5.8 83.48,11.4 | 83.48,11.4 83.26,11.18 R25.1 80.39,11.48 80.39,11.68 v80.01,12.07 | U3.14 45.81,19 v46.06,18.76
  Bottom 0.152: v46.06,18.76 46.06,18.68 52.55,12.19 79.88,12.19 v80.01,12.07
STAT_LED1  (via drill 0.3)
  Top 0.254: U3.33 25.52,8.84 v25.43,8.94 | v10.69,20.29 9.4,21.59 R1.2
  Bottom 0.254: v25.43,8.94 25.09,8.94 18.59,15.45 16.59,15.45 11.74,20.29 v10.69,20.29
STAT_LED2  (via drill 0.3)
  Top 0.254: U3.31 24.96,11.38 v24.31,12.04 | v10.46,23.39 7.92,23.39 R2.2
  Bottom 0.254: v24.31,12.04 24.31,15.49 16.4,23.39 v10.46,23.39
STAT_LED3  (via drill 0.3)
  Top 0.254: U3.30 26.22,12.65 v25.58,12.01 | v10.44,25.65 R3.2
  Bottom 0.254: v25.58,12.01 25.58,14.81 14.73,25.65 v10.44,25.65
TXD0
  Top 0.254: U1.4 13.91,12.39 16.96,12.39 18.09,11.27 18.09,6.55 19.94,4.7 R7.1
VBUS
  Top 0.508: USB1.1 8.51,9.05 8.89,9.42 L1.1
VCC2
  Top 0.152: D6.6
  Top 0.254: R29.2 R30.2 99.99,27.22 D6.4 101.32,29.31 101.98,29.97 101.98,32.39 101.45,32.91 D6.6
VDD_CORE
  Top 0.254: IC2.2 27.23,46.97 26.75,46.48 R12.1 R11.2

### Text on the board
tPlace: FrogDemoBoard / Jan 27 2022